# EAGLE schematic PulseRain_M10 (EAGLE 7.7.0)

## Sheet 1 of 14
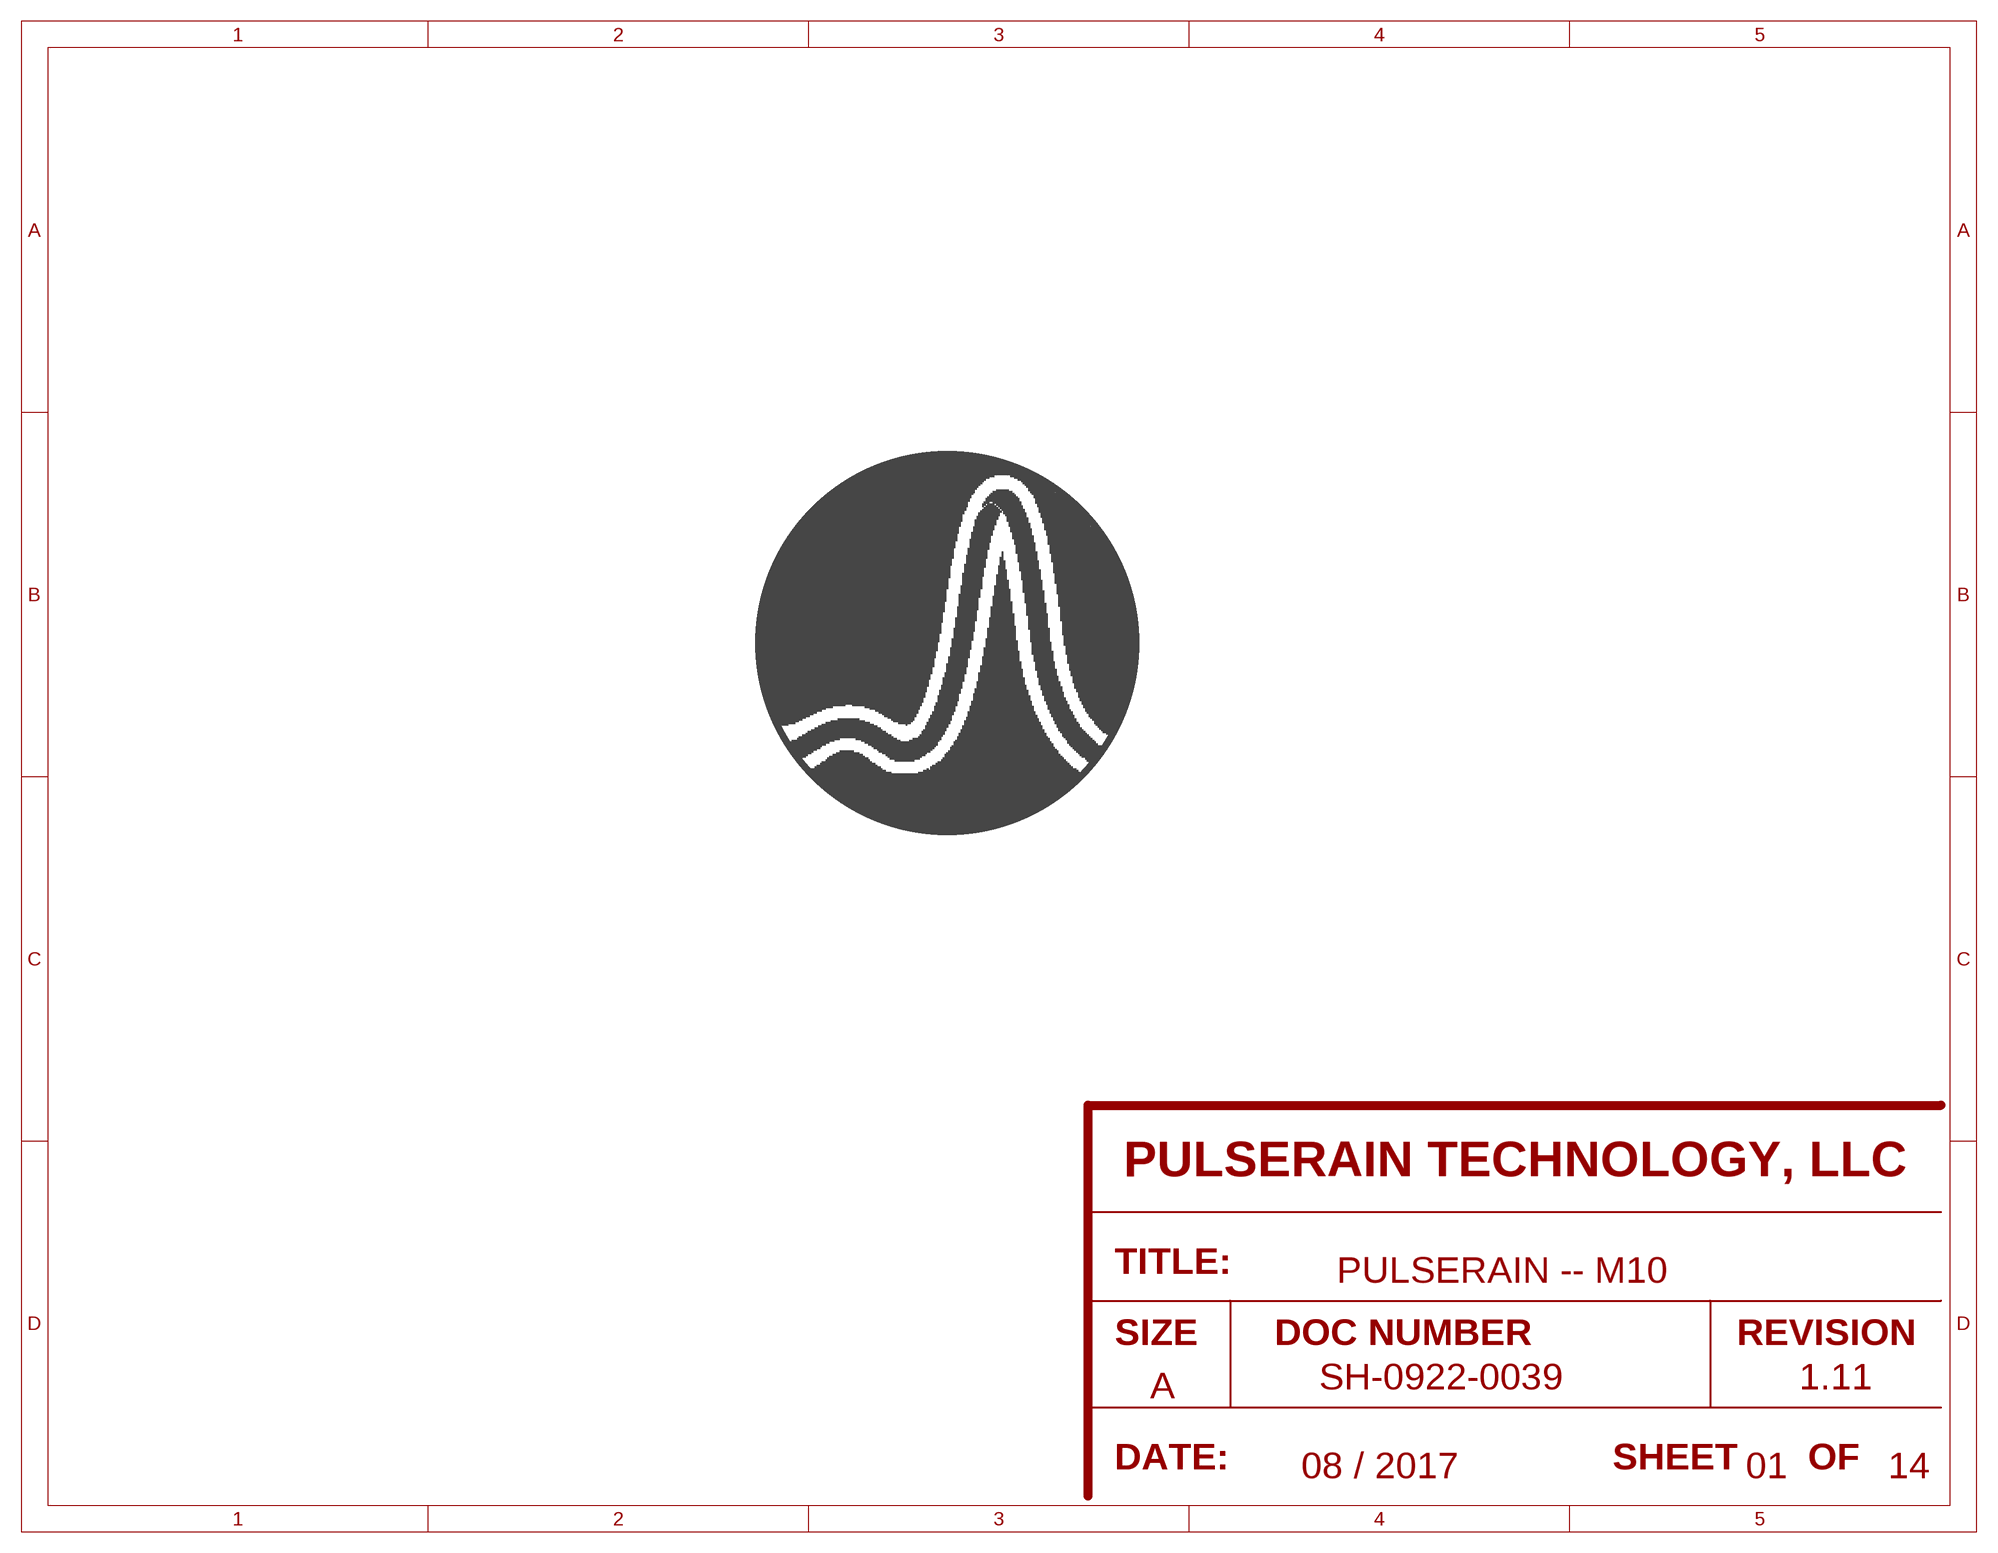
[diagram p0: schematic, sheet 1]

### Parts
GND  PULSERAIN_LOGO_BIGGER  [PULSERAIN_LOGO_BIGGER]

### Notes on the sheet
- PULSERAIN -- M10
- SH-0922-0039 | 1.11
- 08 / 2017 | 01 | 14

## Sheet 2 of 14
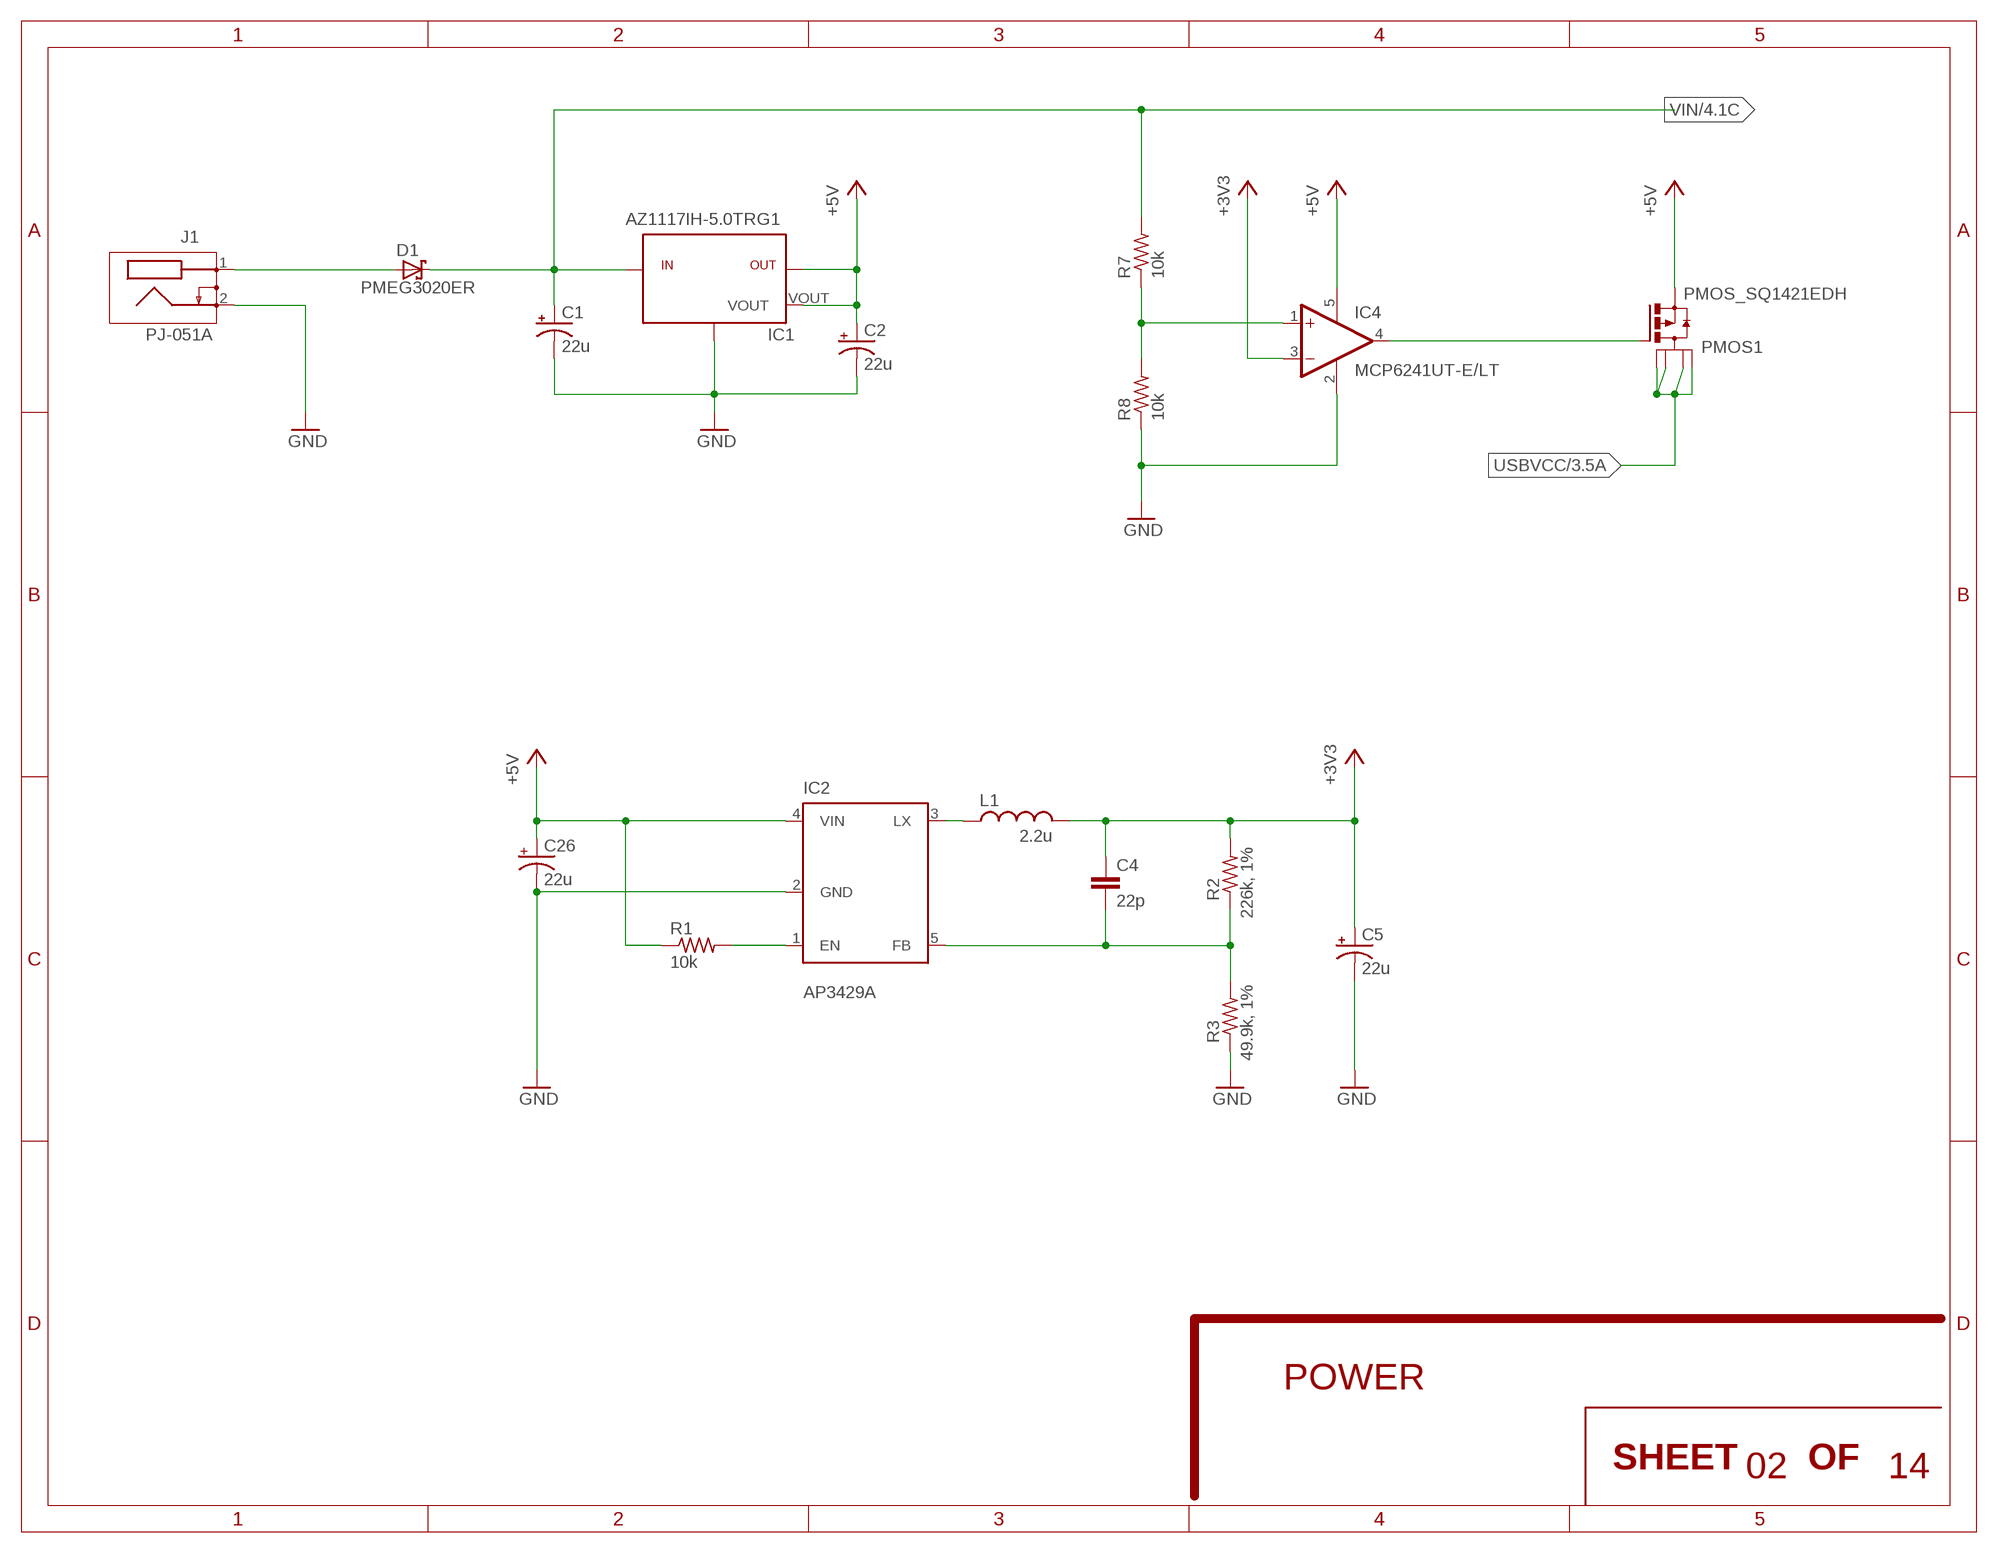
[diagram p1: schematic, sheet 2]

### Parts
C1  22u  CPOL_USB22U  [PANASONIC_B]
C2  22u  CPOL_USB22U  [PANASONIC_B]
C4  22p  C-US_22P  [0603-CAP]
C5  22u  CPOL_USB22U  [PANASONIC_B]
C26  22u  CPOL_USB22U  [PANASONIC_B]
D1  PMEG3020ER  [SOD123W]
IC1  AZ1117IH-5.0TRG1  [SOT223]
IC2  AP3429A  [TSOT25]
IC4  MCP6241UT-E/LT  [SC-70-5]
J1  PJ-051A  [PJ-051A]
L1  2.2u  L-US_2.2U  [DFE252012C]
PMOS1  PMOS_SQ1421EDH  [SC70-6L]
R1  10k  R-US_10K_YAGEO  [VISHAY-R-0603]
R2  226k, 1%  R-US_226K  [VISHAY-R-0603]
R3  49.9k, 1%  R-US_49K9  [VISHAY-R-0603]
R7  10k  R-US_10K_YAGEO  [VISHAY-R-0603]
R8  10k  R-US_10K_YAGEO  [VISHAY-R-0603]

### Nets
+3V3 [supply]: C4.1 C5.+ IC4.3(-IN) L1.2 R2.P$2 ; also sheet 3,4,6,7,8,9,10,11,12,13,14
+5V [supply]: C2.+ C26.+ IC1.2 IC1.VOUT IC2.4(VIN) IC4.5(V+) PMOS1.4(S) R1.P$1 ; also sheet 4,5
GND [supply]: C1.- C2.- C5.- C26.- IC1.1 IC2.2(GND) IC4.2(V-) J1.2 R3.P$1 R8.P$1 ; also sheet 3,4,7,8,10,11,12,13,14
N$1 [supply]: D1.2 J1.1
N$3: IC4.1(+IN) R7.P$1 R8.P$2
N$4 [supply]: IC2.3(LX) L1.1
N$5: IC2.1(EN) R1.P$2
N$6: C4.2 IC2.5(FB) R2.P$1 R3.P$2
N$12: IC4.4(OUT) PMOS1.3(G)
USBVCC [supply]: PMOS1.1(D1) PMOS1.2(D2) PMOS1.5(D3) PMOS1.6(D4) ; also sheet 3
VIN [supply]: C1.+ D1.1 IC1.3 R7.P$2 ; also sheet 4

### Notes on the sheet
- POWER
- 02 | 14

## Sheet 3 of 14
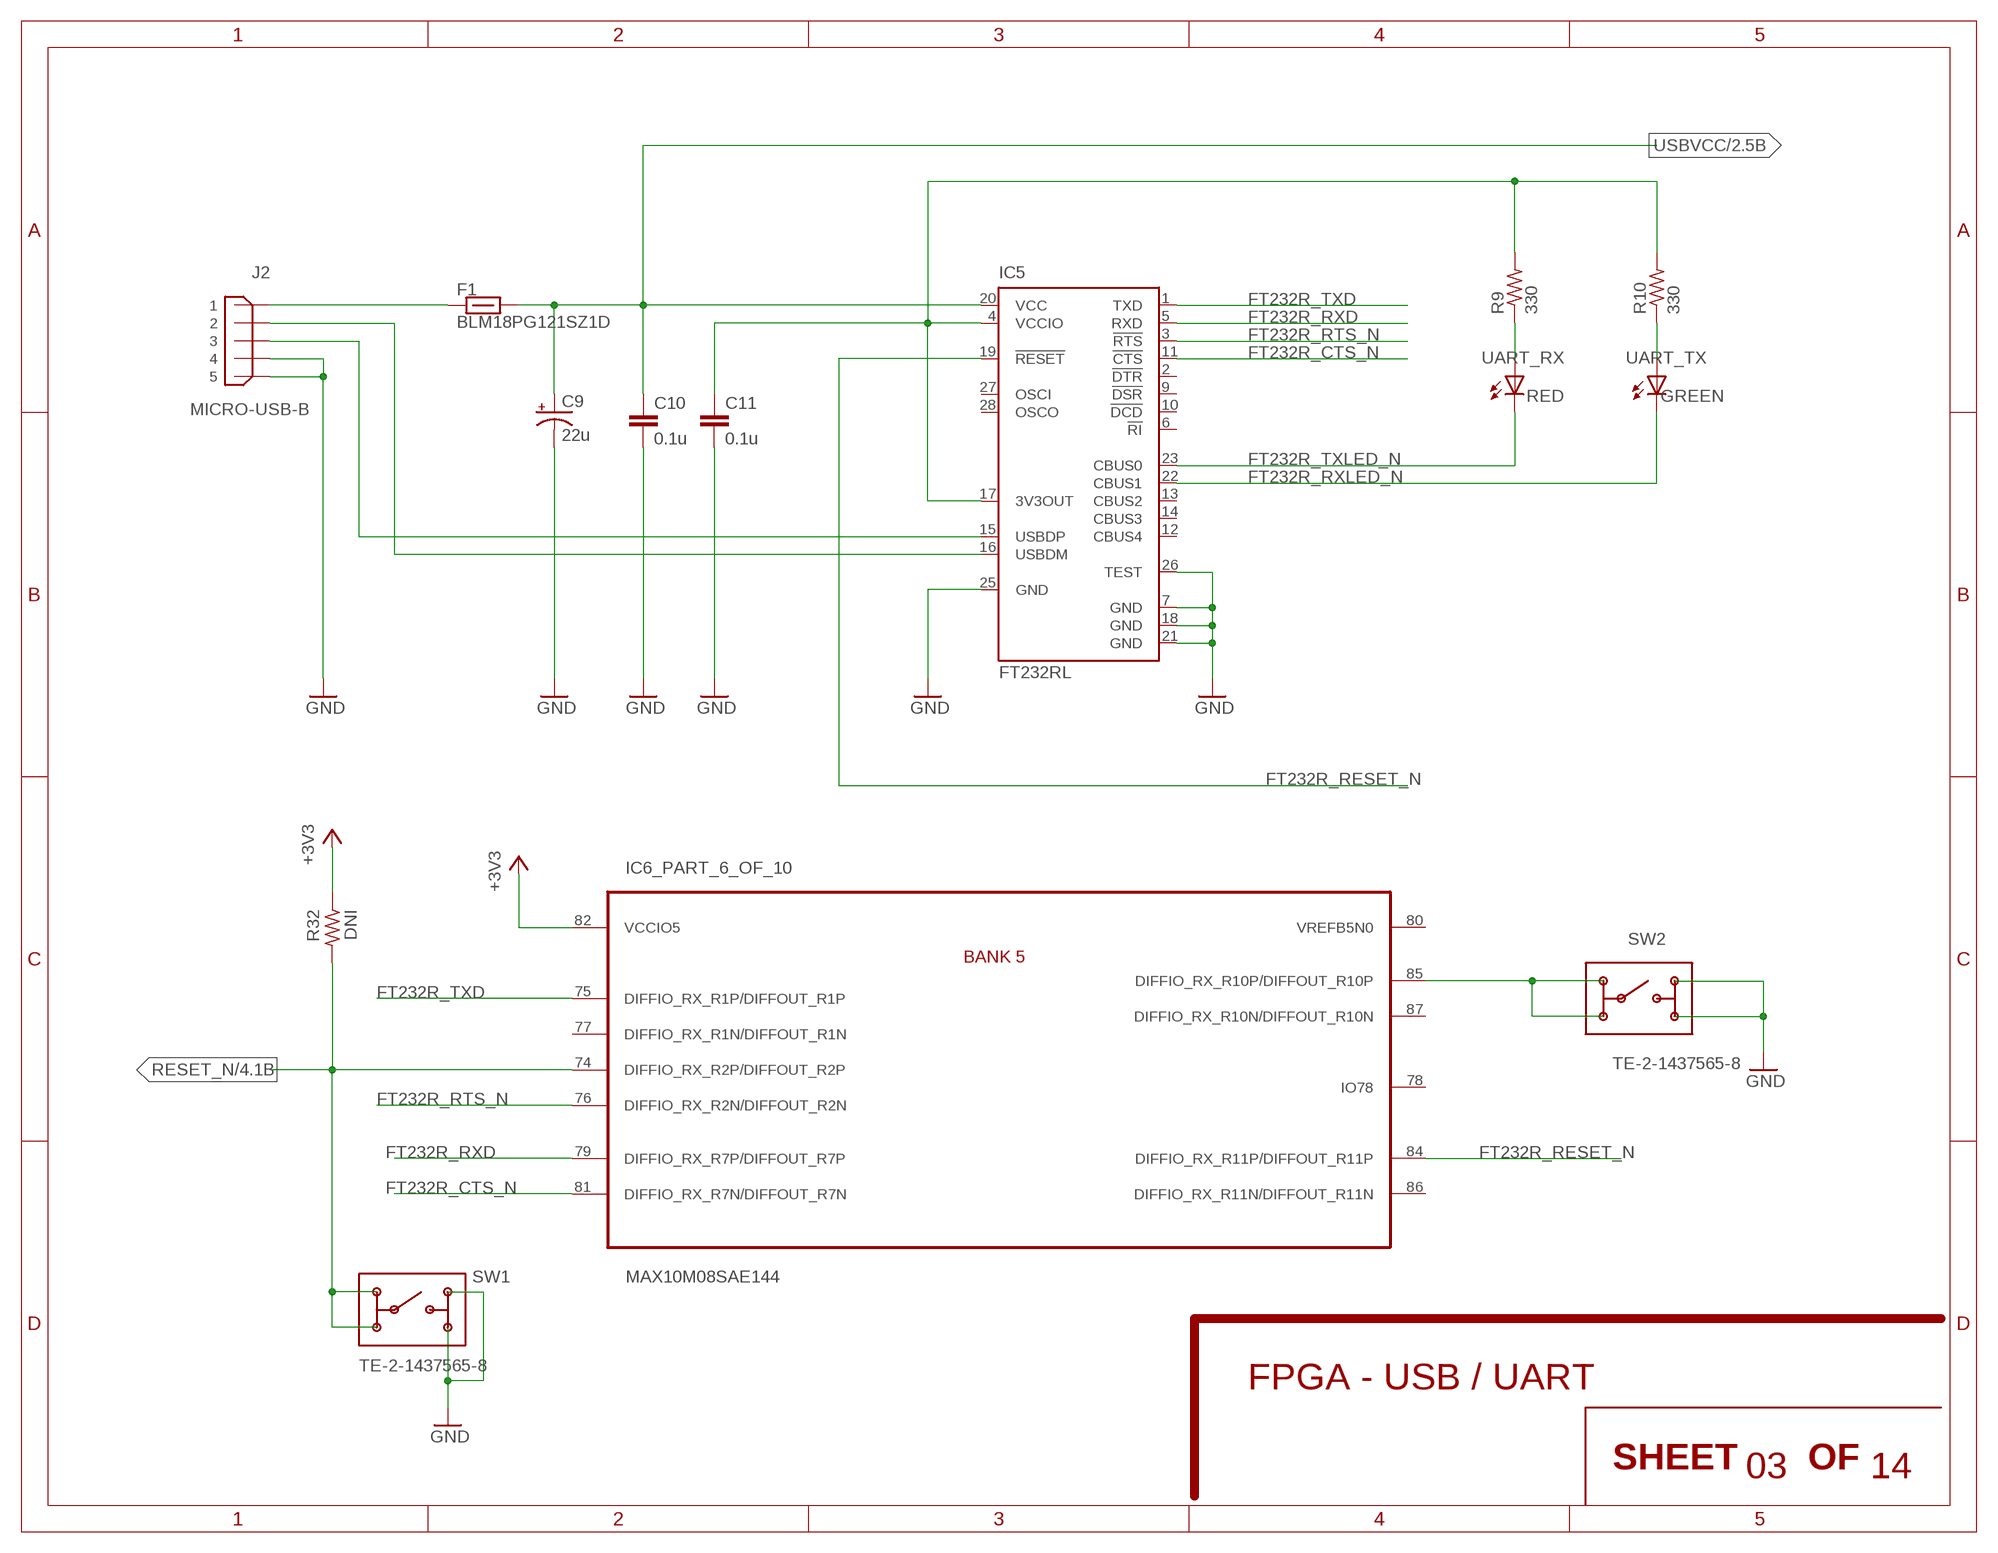
[diagram p2: schematic, sheet 3]

### Parts
C9  22u  CPOL_USB22U  [PANASONIC_B]
C10  0.1u  C-US_0.1U  [0603-CAP]
C11  0.1u  C-US_0.1U  [0603-CAP]
F1  BLM18PG121SZ1D  BLM18PG  [0603-BEAD]
IC5  FT232RL  [SSOP28]
IC6  MAX10M08SAE144  MAX10M08SAE144  [EQFP144]
J2  MICRO-USB-B  MICRO-USB-B-REC-47346-001  [SD-47346-001]
R9  330  R-US_330_YAGEO  [VISHAY-R-0603]
R10  330  R-US_330_YAGEO  [VISHAY-R-0603]
R32  DNI  R-US_10K  [VISHAY-R-0603]
SW1  TE-2-1437565-8  PUSH_BUTTON  [TE-2-1437565-8]
SW2  TE-2-1437565-8  PUSH_BUTTON  [TE-2-1437565-8]
UART_RX  RED  HT--191URO-5502-RED  [HARVATEK_0603]
UART_TX  GREEN  HT--193UYG-5592-GREEN  [HARVATEK_0603]

### Nets
+3V3 [supply]: IC6.82(_PART_6_OF_10:VCCIO5) R32.P$1 ; also sheet 2,4,6,7,8,9,10,11,12,13,14
FT232R_CTS_N: IC5.11(!CTS) IC6.81(_PART_6_OF_10:DIFFIO_RX_R7N/DIFFOUT_R7N)
FT232R_RESET_N: IC5.19(!RESET) IC6.84(_PART_6_OF_10:DIFFIO_RX_R11P/DIFFOUT_R11P)
FT232R_RTS_N: IC5.3(!RTS) IC6.76(_PART_6_OF_10:DIFFIO_RX_R2N/DIFFOUT_R2N)
FT232R_RXD: IC5.5(RXD) IC6.79(_PART_6_OF_10:DIFFIO_RX_R7P/DIFFOUT_R7P)
FT232R_RXLED_N: IC5.22(CBUS1) UART_TX.C
FT232R_TXD: IC5.1(TXD) IC6.75(_PART_6_OF_10:DIFFIO_RX_R1P/DIFFOUT_R1P)
FT232R_TXLED_N: IC5.23(CBUS0) UART_RX.C
GND [supply]: C9.- C10.2 C11.2 IC5.7(GND) IC5.18(GND) IC5.21(GND) IC5.25(GND) IC5.26(TEST) J2.4 J2.5 SW1.3 SW1.4 SW2.3 SW2.4 ; also sheet 2,4,7,8,10,11,12,13,14
N$7 [supply]: F1.1 J2.1
N$13: IC6.85(_PART_6_OF_10:DIFFIO_RX_R10P/DIFFOUT_R10P) SW2.1 SW2.2
N$15 [supply]: C11.1 IC5.4(VCCIO) IC5.17(3V3OUT) R9.P$2 R10.P$2
N$16: R9.P$1 UART_RX.A
N$17: R10.P$1 UART_TX.A
RESET_N: IC6.74(_PART_6_OF_10:DIFFIO_RX_R2P/DIFFOUT_R2P) R32.P$2 SW1.1 SW1.2 ; also sheet 4
USB_DATA_N [diff]: IC5.16(USBDM) J2.2
USB_DATA_P [diff]: IC5.15(USBDP) J2.3
USBVCC [supply]: C9.+ C10.1 F1.2 IC5.20(VCC) ; also sheet 2
Unconnected: IC5.2(!DTR) IC5.6(!RI) IC5.9(!DSR) IC5.10(!DCD) IC5.12(CBUS4) IC5.13(CBUS2) IC5.14(CBUS3) IC5.27(OSCI) IC5.28(OSCO) IC6.77(_PART_6_OF_10:DIFFIO_RX_R1N/DIFFOUT_R1N) IC6.78(_PART_6_OF_10:IO78) IC6.80(_PART_6_OF_10:VREFB5N0) IC6.86(_PART_6_OF_10:DIFFIO_RX_R11N/DIFFOUT_R11N) IC6.87(_PART_6_OF_10:DIFFIO_RX_R10N/DIFFOUT_R10N)

### Notes on the sheet
- FPGA - USB / UART
- 03 | 14

## Sheet 4 of 14
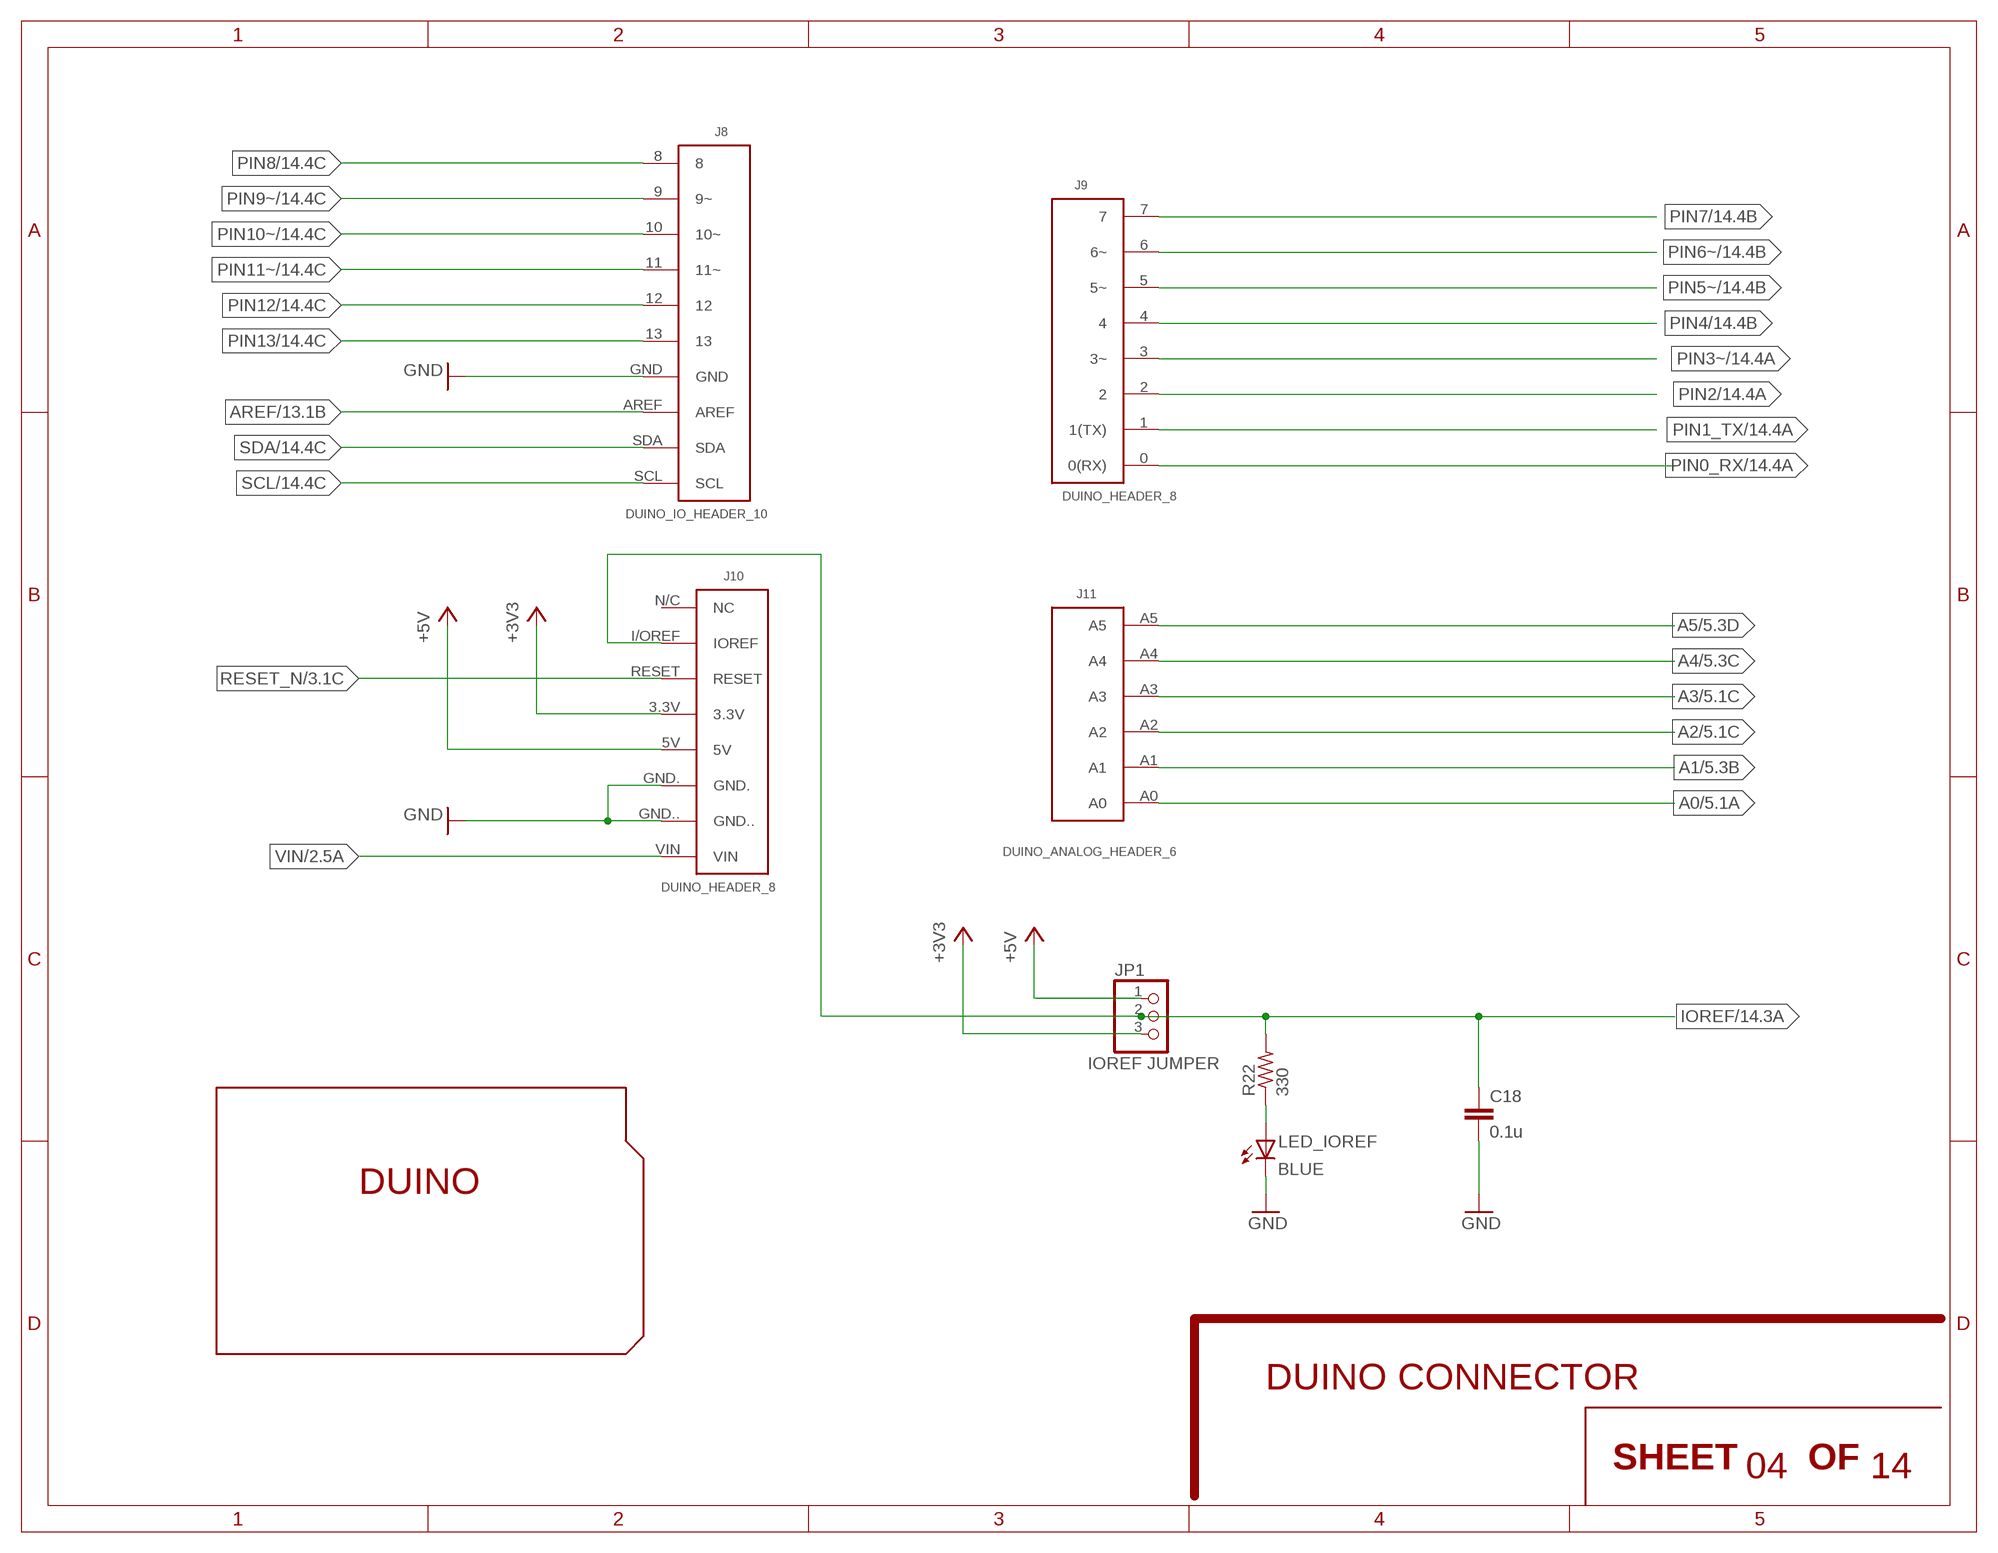
[diagram p3: schematic, sheet 4]

### Parts
C18  0.1u  C-US_0.1U  [0603-CAP]
J8  DUINO_IO_HEADER_10  [DUINO_IO_HEADER_10]
J9  DUINO_HEADER_8  DUINO_IO_HEADER_8  [DUINO_IO_HEADER_8]
J10  DUINO_HEADER_8  DUINO_PWR_HEADER_8  [DUINO_PWR_HEADER_8]
J11  DUINO_ANALOG_HEADER_6  [DUINO_ANALOG_HEADER_6]
JP1  IOREF JUMPER  PINHD-1X3  [1X03]
LED_IOREF  BLUE  HT--193NB-5589-BLUE  [HARVATEK_0603]
R22  330  R-US_330_YAGEO  [VISHAY-R-0603]
U$8  DUINO  [DUINO]

### Nets
+3V3 [supply]: J10.3.3V JP1.3 ; also sheet 2,3,6,7,8,9,10,11,12,13,14
+5V [supply]: J10.5V JP1.1 ; also sheet 2,5
A0: J11.A0 ; also sheet 5
A1: J11.A1 ; also sheet 5
A2: J11.A2 ; also sheet 5
A3: J11.A3 ; also sheet 5
A4: J11.A4 ; also sheet 5
A5: J11.A5 ; also sheet 5
AREF: J8.AREF ; also sheet 13
GND [supply]: C18.2 J8.GND J10.GND. J10.GND.. LED_IOREF.C ; also sheet 2,3,7,8,10,11,12,13,14
IOREF: C18.1 J10.I/OREF(IOREF) JP1.2 R22.P$2 ; also sheet 14
N$18: LED_IOREF.A R22.P$1
PIN0_RX: J9.0(0(RX)) ; also sheet 14
PIN1_TX: J9.1(1(TX)) ; also sheet 14
PIN2: J9.2 ; also sheet 14
PIN3~: J9.3(3~) ; also sheet 14
PIN4: J9.4 ; also sheet 14
PIN5~: J9.5(5~) ; also sheet 14
PIN6~: J9.6(6~) ; also sheet 14
PIN7: J9.7 ; also sheet 14
PIN8: J8.8 ; also sheet 14
PIN9~: J8.9(9~) ; also sheet 14
PIN10~: J8.10(10~) ; also sheet 14
PIN11~: J8.11(11~) ; also sheet 14
PIN12: J8.12 ; also sheet 14
PIN13: J8.13 ; also sheet 14
RESET_N: J10.RESET ; also sheet 3
SCL: J8.SCL ; also sheet 14
SDA: J8.SDA ; also sheet 14
VIN [supply]: J10.VIN ; also sheet 2
Unconnected: J10.N/C(NC)

### Notes on the sheet
- DUINO CONNECTOR
- 04 | 14

## Sheet 5 of 14
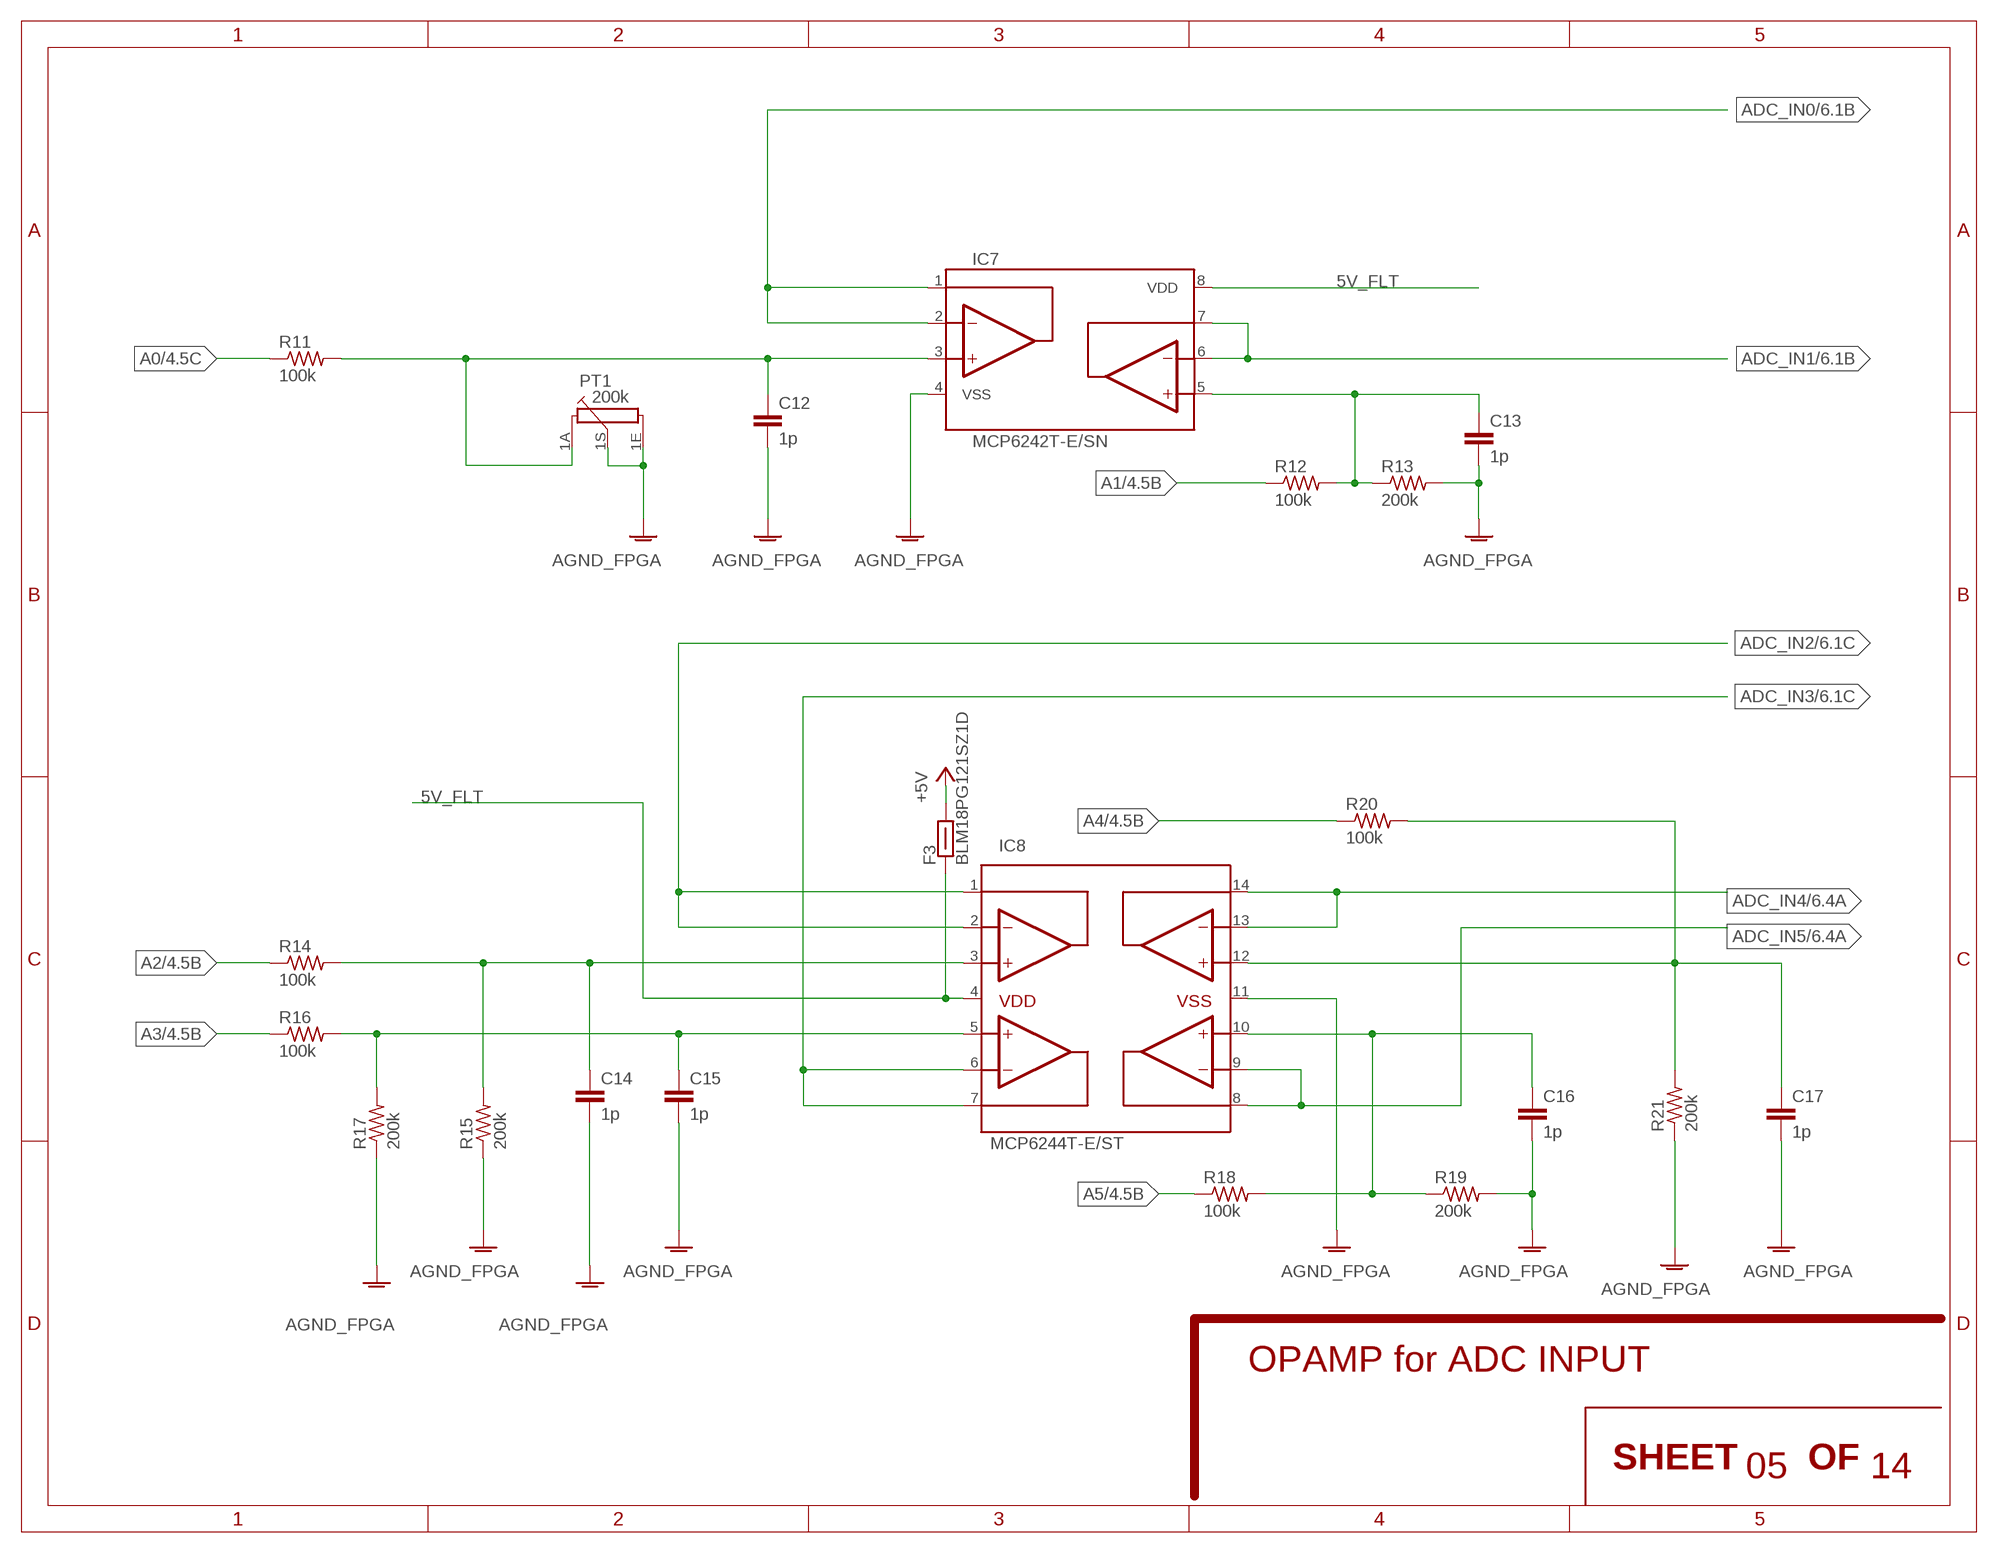
[diagram p4: schematic, sheet 5]

### Parts
C12  1p  C-US_1P  [0603-CAP]
C13  1p  C-US_1P  [0603-CAP]
C14  1p  C-US_1P  [0603-CAP]
C15  1p  C-US_1P  [0603-CAP]
C16  1p  C-US_1P  [0603-CAP]
C17  1p  C-US_1P  [0603-CAP]
F3  BLM18PG121SZ1D  BLM18PG  [0603-BEAD]
IC7  MCP6242T-E/SN  [SOIC-SN-8]
IC8  MCP6244T-E/ST  [TSSOP-ST-14]
PT1  200k  PT10LV10  [PT10LV10]
R11  100k  R-US_100K_YAGEO  [VISHAY-R-0603]
R12  100k  R-US_100K_YAGEO  [VISHAY-R-0603]
R13  200k  R-US_200K  [VISHAY-R-0603]
R14  100k  R-US_100K_YAGEO  [VISHAY-R-0603]
R15  200k  R-US_200K  [VISHAY-R-0603]
R16  100k  R-US_100K_YAGEO  [VISHAY-R-0603]
R17  200k  R-US_200K  [VISHAY-R-0603]
R18  100k  R-US_100K_YAGEO  [VISHAY-R-0603]
R19  200k  R-US_200K  [VISHAY-R-0603]
R20  100k  R-US_100K_YAGEO  [VISHAY-R-0603]
R21  200k  R-US_200K  [VISHAY-R-0603]

### Nets
5V_FLT: F3.1 IC7.8(VDD) IC8.4
+5V [supply]: F3.2 ; also sheet 2,4
A0: R11.P$1 ; also sheet 4
A1: R12.P$1 ; also sheet 4
A2: R14.P$1 ; also sheet 4
A3: R16.P$1 ; also sheet 4
A4: R20.P$1 ; also sheet 4
A5: R18.P$1 ; also sheet 4
ADC_IN0: IC7.1 IC7.2 ; also sheet 6
ADC_IN1: IC7.6 IC7.7 ; also sheet 6
ADC_IN2: IC8.1 IC8.2 ; also sheet 6
ADC_IN3: IC8.6 IC8.7 ; also sheet 6
ADC_IN4: IC8.13 IC8.14 ; also sheet 6
ADC_IN5: IC8.8 IC8.9 ; also sheet 6
AGND_FPGA [supply]: C12.2 C13.2 C14.2 C15.2 C16.2 C17.2 IC7.4(VSS) IC8.11 PT1.1E PT1.1S R13.P$2 R15.P$1 R17.P$1 R19.P$2 R21.P$1 ; also sheet 6,13
N$19: C13.1 IC7.5 R12.P$2 R13.P$1
N$20: C16.1 IC8.10 R18.P$2 R19.P$1
N$22: C14.1 IC8.3 R14.P$2 R15.P$2
N$23: C15.1 IC8.5 R16.P$2 R17.P$2
N$27: C12.1 IC7.3 PT1.1A R11.P$2
N$28: C17.1 IC8.12 R20.P$2 R21.P$2

### Notes on the sheet
- OPAMP for ADC INPUT
- 05 | 14

## Sheet 6 of 14
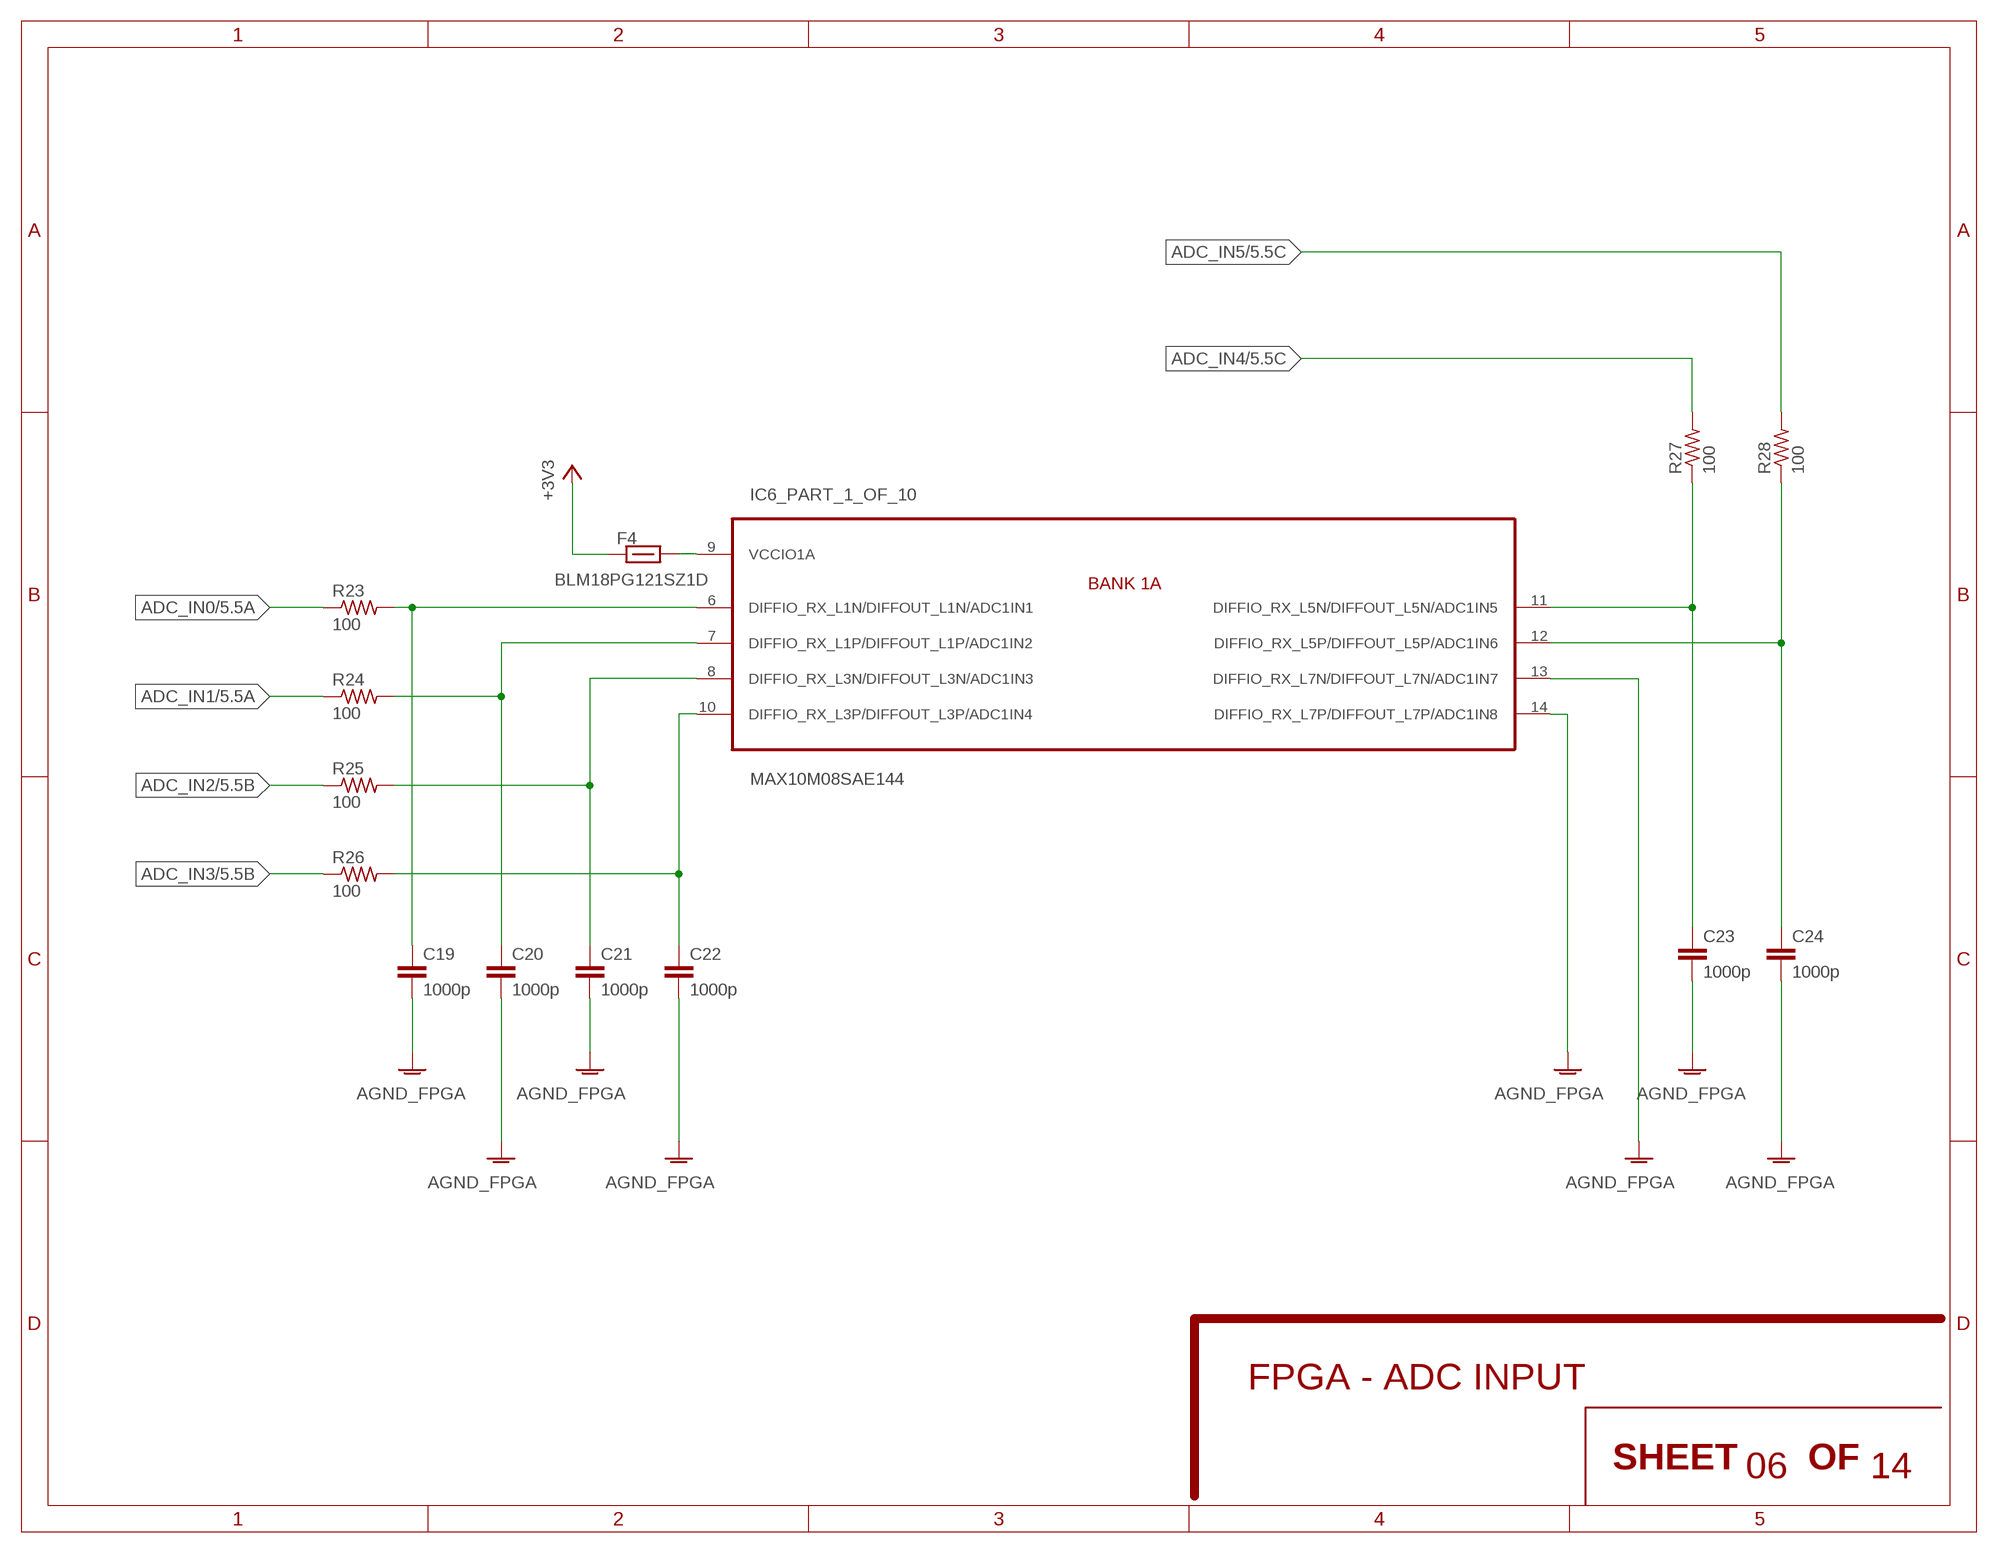
[diagram p5: schematic, sheet 6]

### Parts
C19  1000p  C-US_1000P  [VISHAY-R-0603]
C20  1000p  C-US_1000P  [VISHAY-R-0603]
C21  1000p  C-US_1000P  [VISHAY-R-0603]
C22  1000p  C-US_1000P  [VISHAY-R-0603]
C23  1000p  C-US_1000P  [VISHAY-R-0603]
C24  1000p  C-US_1000P  [VISHAY-R-0603]
F4  BLM18PG121SZ1D  BLM18PG  [0603-BEAD]
R23  100  R-US_100  [VISHAY-R-0603]
R24  100  R-US_100  [VISHAY-R-0603]
R25  100  R-US_100  [VISHAY-R-0603]
R26  100  R-US_100  [VISHAY-R-0603]
R27  100  R-US_100  [VISHAY-R-0603]
R28  100  R-US_100  [VISHAY-R-0603]

### Nets
+3V3 [supply]: F4.1 ; also sheet 2,3,4,7,8,9,10,11,12,13,14
ADC_IN0: R23.P$1 ; also sheet 5
ADC_IN1: R24.P$1 ; also sheet 5
ADC_IN2: R25.P$1 ; also sheet 5
ADC_IN3: R26.P$1 ; also sheet 5
ADC_IN4: R27.P$2 ; also sheet 5
ADC_IN5: R28.P$2 ; also sheet 5
AGND_FPGA [supply]: C19.P$2 C20.P$2 C21.P$2 C22.P$2 C23.P$2 C24.P$2 IC6.13(_PART_1_OF_10:DIFFIO_RX_L7N/DIFFOUT_L7N/ADC1IN7) IC6.14(_PART_1_OF_10:DIFFIO_RX_L7P/DIFFOUT_L7P/ADC1IN8) ; also sheet 5,13
N$14: C23.P$1 IC6.11(_PART_1_OF_10:DIFFIO_RX_L5N/DIFFOUT_L5N/ADC1IN5) R27.P$1
N$24: C19.P$1 IC6.6(_PART_1_OF_10:DIFFIO_RX_L1N/DIFFOUT_L1N/ADC1IN1) R23.P$2
N$25: C20.P$1 IC6.7(_PART_1_OF_10:DIFFIO_RX_L1P/DIFFOUT_L1P/ADC1IN2) R24.P$2
N$26: C21.P$1 IC6.8(_PART_1_OF_10:DIFFIO_RX_L3N/DIFFOUT_L3N/ADC1IN3) R25.P$2
N$29: C22.P$1 IC6.10(_PART_1_OF_10:DIFFIO_RX_L3P/DIFFOUT_L3P/ADC1IN4) R26.P$2
N$30: C24.P$1 IC6.12(_PART_1_OF_10:DIFFIO_RX_L5P/DIFFOUT_L5P/ADC1IN6) R28.P$1
N$34: F4.2 IC6.9(_PART_1_OF_10:VCCIO1A)

### Notes on the sheet
- FPGA - ADC INPUT
- 06 | 14

## Sheet 7 of 14
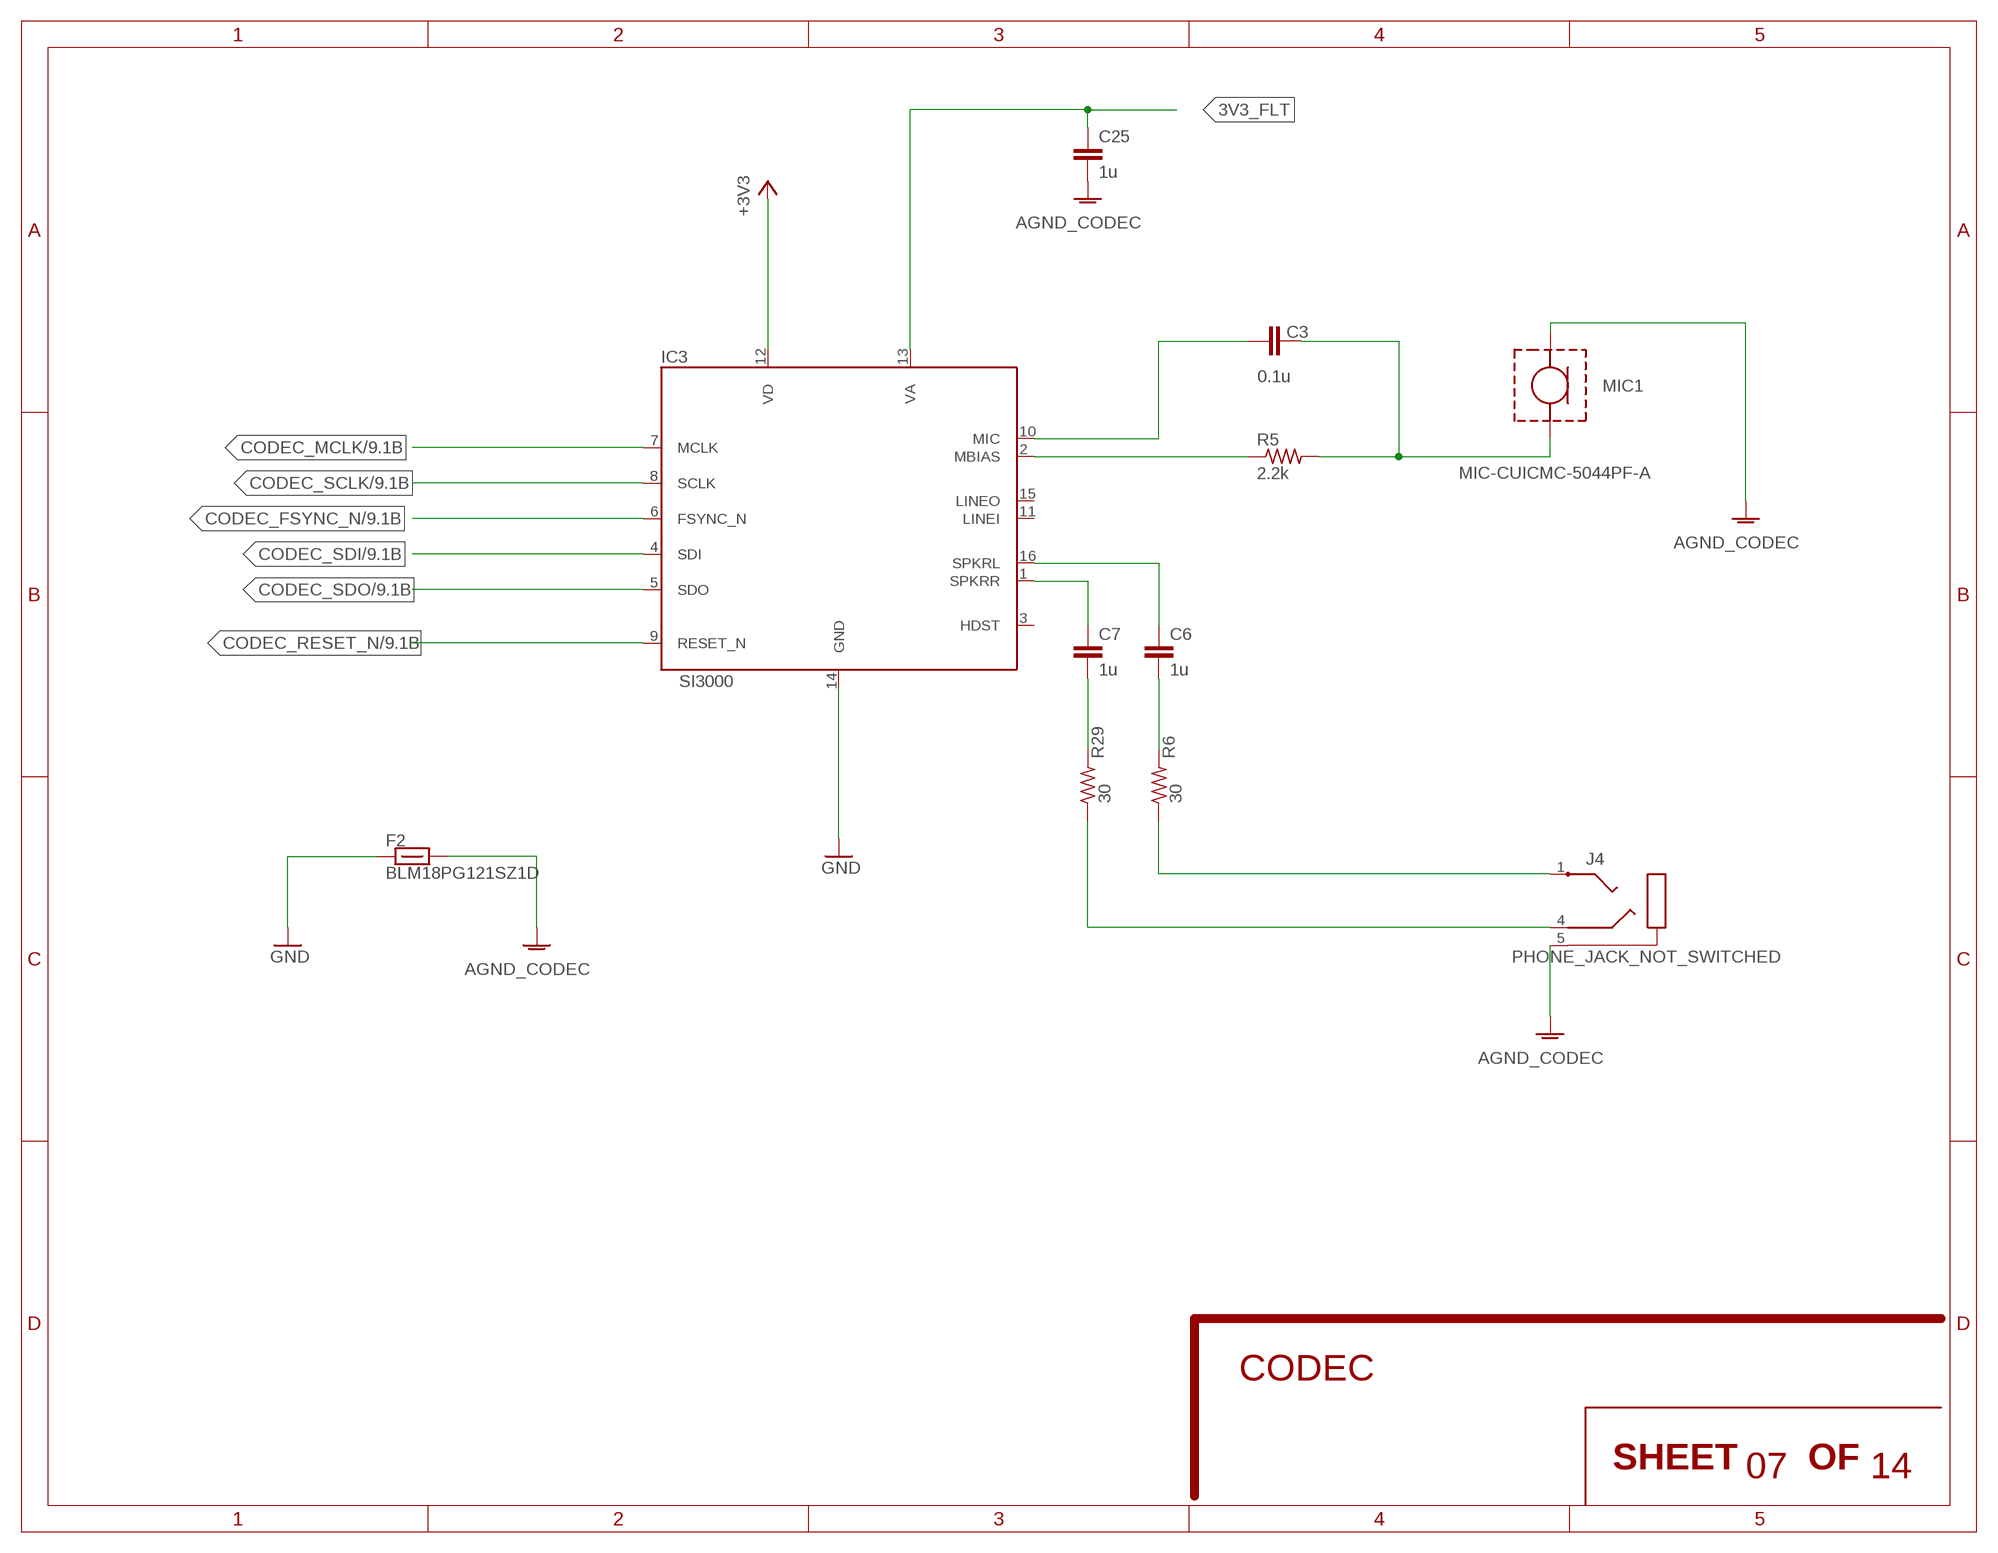
[diagram p6: schematic, sheet 7]

### Parts
C3  0.1u  C-US_0.1U  [0603-CAP]
C6  1u  C-US_1U  [VISHAY-R-0603]
C7  1u  C-US_1U  [VISHAY-R-0603]
C25  1u  C-US_1U  [VISHAY-R-0603]
F2  BLM18PG121SZ1D  BLM18PG  [0603-BEAD]
IC3  SI3000  SI3000-C-FS  [SOIC-16]
J4  PHONE_JACK_NOT_SWITCHED  [PHONE_JACK_NOT_SWITCHED]
MIC1  MIC-CUICMC-5044PF-A  [CMC-5044PF-A]
R5  2.2k  R-US_2.2K  [VISHAY-R-0603]
R6  30  R-US_30  [VISHAY-R-0603]
R29  30  R-US_30  [VISHAY-R-0603]

### Nets
3V3_FLT: C25.P$1 IC3.13(VA) ; also sheet 13
+3V3 [supply]: IC3.12(VD) ; also sheet 2,3,4,6,8,9,10,11,12,13,14
AGND_CODEC [supply]: C25.P$2 F2.2 J4.5 MIC1.1
CODEC_FSYNC_N: IC3.6(FSYNC_N) ; also sheet 9
CODEC_MCLK: IC3.7(MCLK) ; also sheet 9
CODEC_RESET_N: IC3.9(RESET_N) ; also sheet 9
CODEC_SCLK: IC3.8(SCLK) ; also sheet 9
CODEC_SDI: IC3.4(SDI) ; also sheet 9
CODEC_SDO: IC3.5(SDO) ; also sheet 9
GND [supply]: F2.1 IC3.14(GND) ; also sheet 2,3,4,8,10,11,12,13,14
N$8: C3.1 IC3.10(MIC)
N$9: C6.P$1 IC3.16(SPKRL)
N$10: C3.2 MIC1.2 R5.P$2
N$36: IC3.2(MBIAS) R5.P$1
N$37: C7.P$1 IC3.1(SPKRR)
N$39: C7.P$2 R29.P$2
N$41: C6.P$2 R6.P$2
N$42: J4.1 R6.P$1
N$43: J4.4 R29.P$1
Unconnected: IC3.3(HDST) IC3.11(LINEI) IC3.15(LINEO)

### Notes on the sheet
- CODEC
- 07 | 14

## Sheet 8 of 14
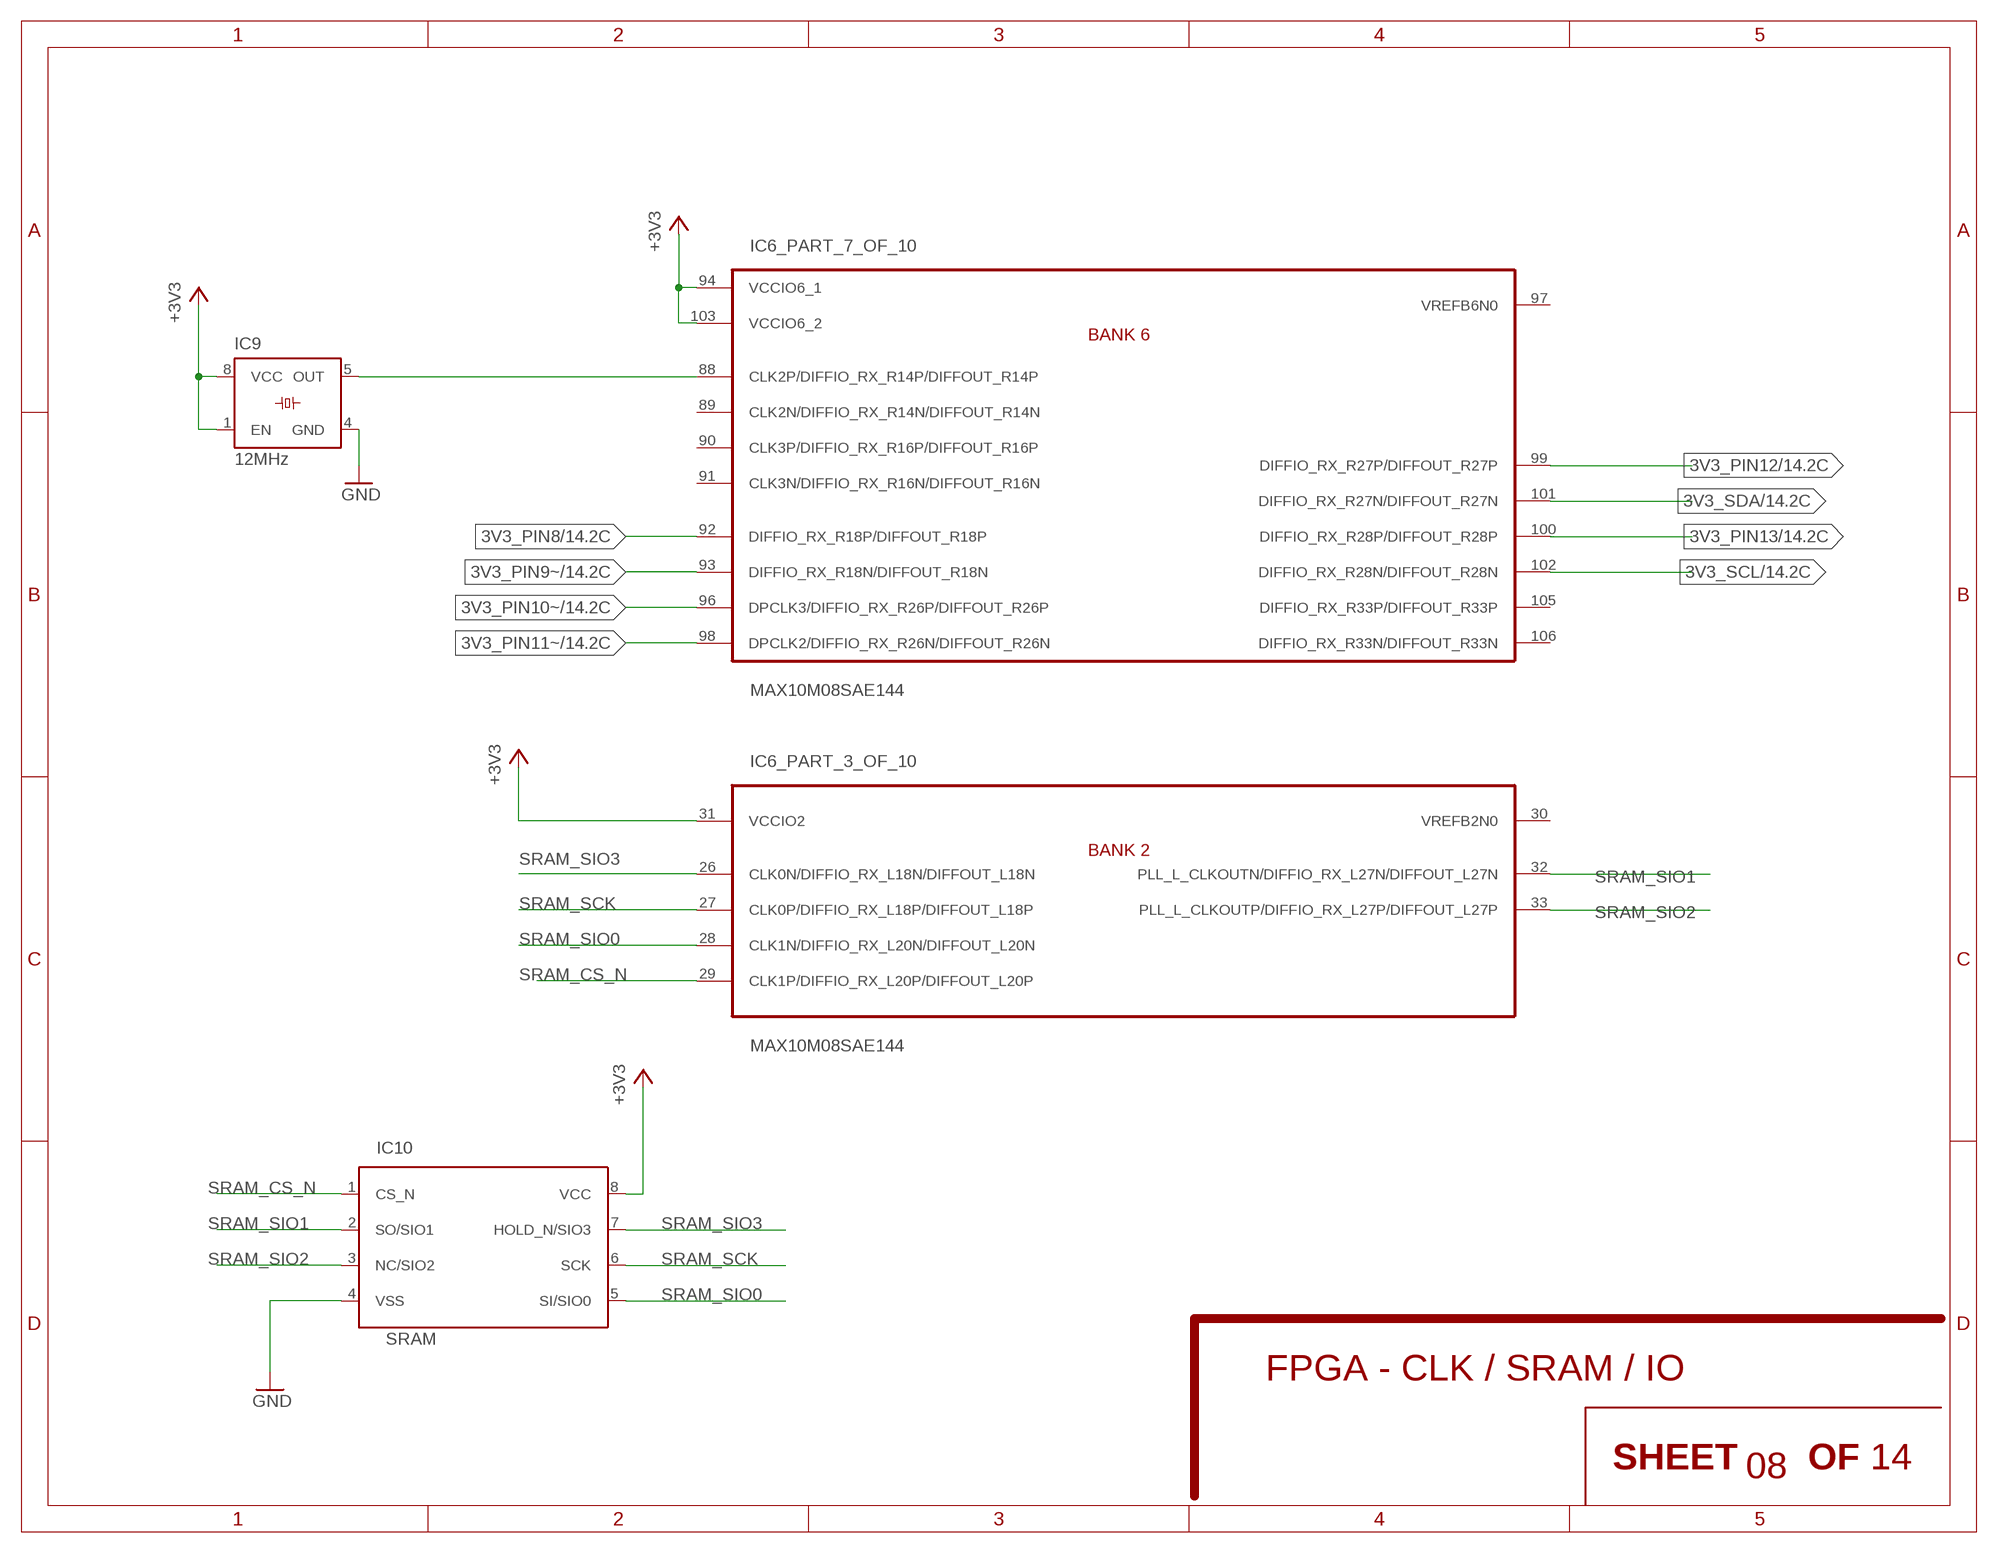
[diagram p7: schematic, sheet 8]

### Parts
IC9  12MHz  ACHL-DIPACHL-12.000MHZ-EK  [ACHL-DIP]
IC10  SRAM  23LC1024  [TSSOP-ST-8]

### Nets
3V3_PIN8: IC6.92(_PART_7_OF_10:DIFFIO_RX_R18P/DIFFOUT_R18P) ; also sheet 14
3V3_PIN9~: IC6.93(_PART_7_OF_10:DIFFIO_RX_R18N/DIFFOUT_R18N) ; also sheet 14
3V3_PIN10~: IC6.96(_PART_7_OF_10:DPCLK3/DIFFIO_RX_R26P/DIFFOUT_R26P) ; also sheet 14
3V3_PIN11~: IC6.98(_PART_7_OF_10:DPCLK2/DIFFIO_RX_R26N/DIFFOUT_R26N) ; also sheet 14
3V3_PIN12: IC6.99(_PART_7_OF_10:DIFFIO_RX_R27P/DIFFOUT_R27P) ; also sheet 14
3V3_PIN13: IC6.100(_PART_7_OF_10:DIFFIO_RX_R28P/DIFFOUT_R28P) ; also sheet 14
3V3_SCL: IC6.102(_PART_7_OF_10:DIFFIO_RX_R28N/DIFFOUT_R28N) ; also sheet 14
3V3_SDA: IC6.101(_PART_7_OF_10:DIFFIO_RX_R27N/DIFFOUT_R27N) ; also sheet 14
+3V3 [supply]: IC6.31(_PART_3_OF_10:VCCIO2) IC6.94(_PART_7_OF_10:VCCIO6_1) IC6.103(_PART_7_OF_10:VCCIO6_2) IC9.1(EN) IC9.8(VCC) IC10.8(VCC) ; also sheet 2,3,4,6,7,9,10,11,12,13,14
GND [supply]: IC9.4(GND) IC10.4(VSS) ; also sheet 2,3,4,7,10,11,12,13,14
N$2: IC6.88(_PART_7_OF_10:CLK2P/DIFFIO_RX_R14P/DIFFOUT_R14P) IC9.5(OUT)
SRAM_CS_N: IC6.29(_PART_3_OF_10:CLK1P/DIFFIO_RX_L20P/DIFFOUT_L20P) IC10.1(CS_N)
SRAM_SCK: IC6.27(_PART_3_OF_10:CLK0P/DIFFIO_RX_L18P/DIFFOUT_L18P) IC10.6(SCK)
SRAM_SIO0: IC6.28(_PART_3_OF_10:CLK1N/DIFFIO_RX_L20N/DIFFOUT_L20N) IC10.5(SI/SIO0)
SRAM_SIO1: IC6.32(_PART_3_OF_10:PLL_L_CLKOUTN/DIFFIO_RX_L27N/DIFFOUT_L27N) IC10.2(SO/SIO1)
SRAM_SIO2: IC6.33(_PART_3_OF_10:PLL_L_CLKOUTP/DIFFIO_RX_L27P/DIFFOUT_L27P) IC10.3(NC/SIO2)
SRAM_SIO3: IC6.26(_PART_3_OF_10:CLK0N/DIFFIO_RX_L18N/DIFFOUT_L18N) IC10.7(HOLD_N/SIO3)
Unconnected: IC6.30(_PART_3_OF_10:VREFB2N0) IC6.89(_PART_7_OF_10:CLK2N/DIFFIO_RX_R14N/DIFFOUT_R14N) IC6.90(_PART_7_OF_10:CLK3P/DIFFIO_RX_R16P/DIFFOUT_R16P) IC6.91(_PART_7_OF_10:CLK3N/DIFFIO_RX_R16N/DIFFOUT_R16N) IC6.97(_PART_7_OF_10:VREFB6N0) IC6.105(_PART_7_OF_10:DIFFIO_RX_R33P/DIFFOUT_R33P) IC6.106(_PART_7_OF_10:DIFFIO_RX_R33N/DIFFOUT_R33N)

### Notes on the sheet
- FPGA - CLK / SRAM / IO
- 08 | 14

## Sheet 9 of 14
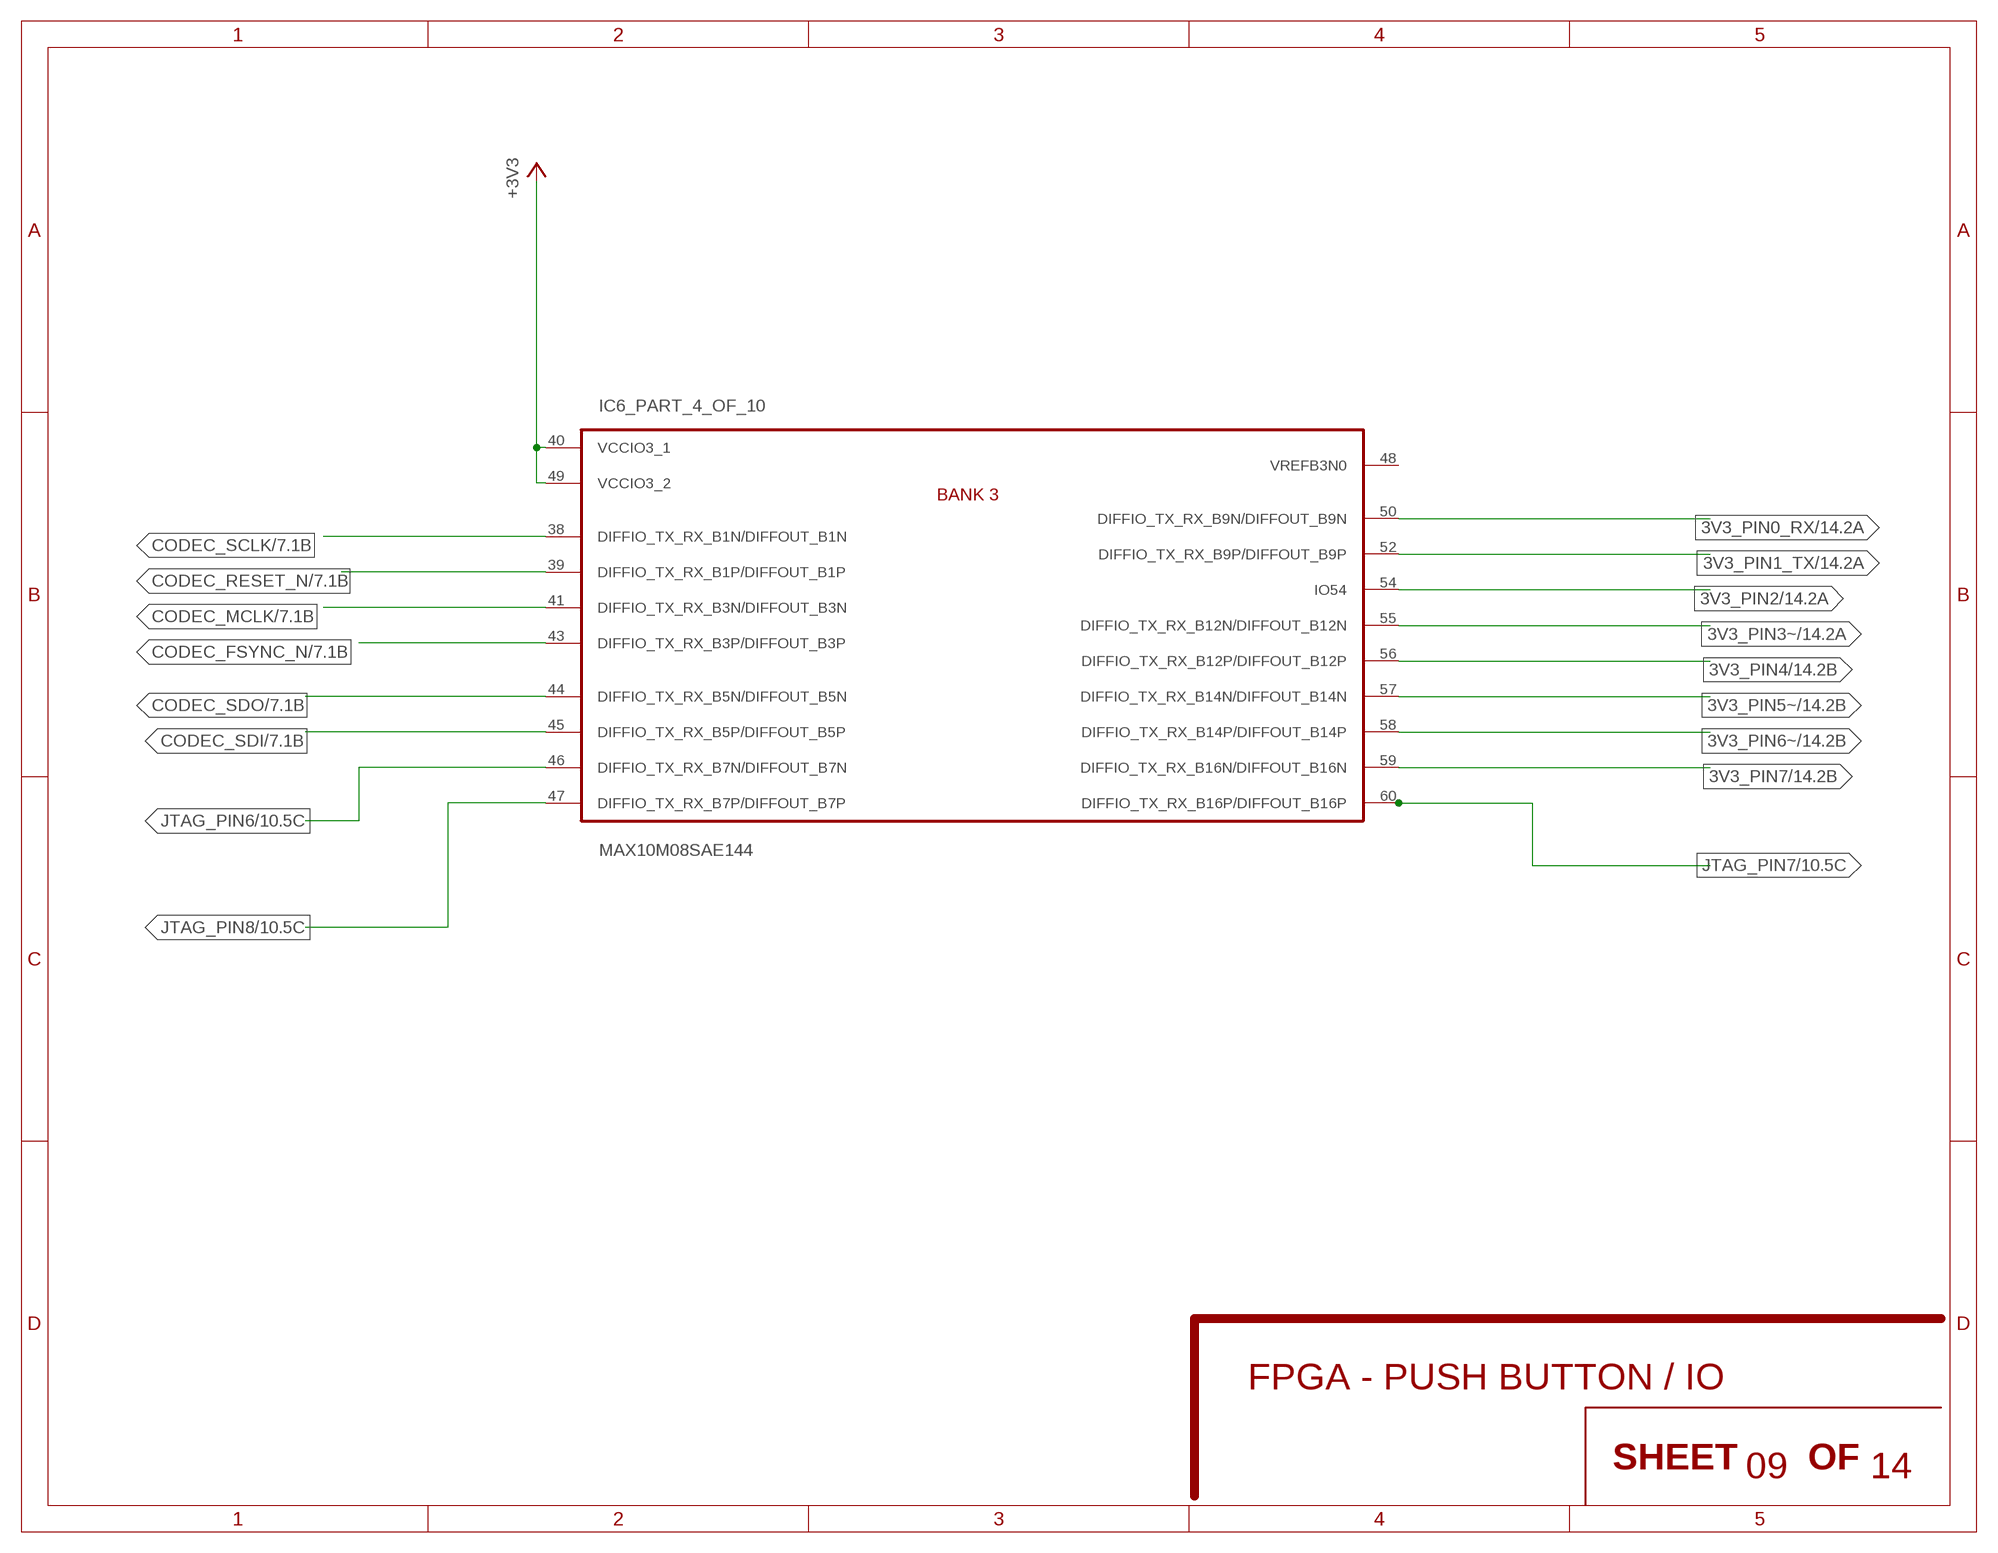
[diagram p8: schematic, sheet 9]

### Nets
3V3_PIN0_RX: IC6.50(_PART_4_OF_10:DIFFIO_TX_RX_B9N/DIFFOUT_B9N) ; also sheet 14
3V3_PIN1_TX: IC6.52(_PART_4_OF_10:DIFFIO_TX_RX_B9P/DIFFOUT_B9P) ; also sheet 14
3V3_PIN2: IC6.54(_PART_4_OF_10:IO54) ; also sheet 14
3V3_PIN3~: IC6.55(_PART_4_OF_10:DIFFIO_TX_RX_B12N/DIFFOUT_B12N) ; also sheet 14
3V3_PIN4: IC6.56(_PART_4_OF_10:DIFFIO_TX_RX_B12P/DIFFOUT_B12P) ; also sheet 14
3V3_PIN5~: IC6.57(_PART_4_OF_10:DIFFIO_TX_RX_B14N/DIFFOUT_B14N) ; also sheet 14
3V3_PIN6~: IC6.58(_PART_4_OF_10:DIFFIO_TX_RX_B14P/DIFFOUT_B14P) ; also sheet 14
3V3_PIN7: IC6.59(_PART_4_OF_10:DIFFIO_TX_RX_B16N/DIFFOUT_B16N) ; also sheet 14
+3V3 [supply]: IC6.40(_PART_4_OF_10:VCCIO3_1) IC6.49(_PART_4_OF_10:VCCIO3_2) ; also sheet 2,3,4,6,7,8,10,11,12,13,14
CODEC_FSYNC_N: IC6.43(_PART_4_OF_10:DIFFIO_TX_RX_B3P/DIFFOUT_B3P) ; also sheet 7
CODEC_MCLK: IC6.41(_PART_4_OF_10:DIFFIO_TX_RX_B3N/DIFFOUT_B3N) ; also sheet 7
CODEC_RESET_N: IC6.39(_PART_4_OF_10:DIFFIO_TX_RX_B1P/DIFFOUT_B1P) ; also sheet 7
CODEC_SCLK: IC6.38(_PART_4_OF_10:DIFFIO_TX_RX_B1N/DIFFOUT_B1N) ; also sheet 7
CODEC_SDI: IC6.45(_PART_4_OF_10:DIFFIO_TX_RX_B5P/DIFFOUT_B5P) ; also sheet 7
CODEC_SDO: IC6.44(_PART_4_OF_10:DIFFIO_TX_RX_B5N/DIFFOUT_B5N) ; also sheet 7
JTAG_PIN6: IC6.46(_PART_4_OF_10:DIFFIO_TX_RX_B7N/DIFFOUT_B7N) ; also sheet 10
JTAG_PIN7: IC6.60(_PART_4_OF_10:DIFFIO_TX_RX_B16P/DIFFOUT_B16P) ; also sheet 10
JTAG_PIN8: IC6.47(_PART_4_OF_10:DIFFIO_TX_RX_B7P/DIFFOUT_B7P) ; also sheet 10
Unconnected: IC6.48(_PART_4_OF_10:VREFB3N0)

### Notes on the sheet
- FPGA - PUSH BUTTON / IO
- 09 | 14

## Sheet 10 of 14
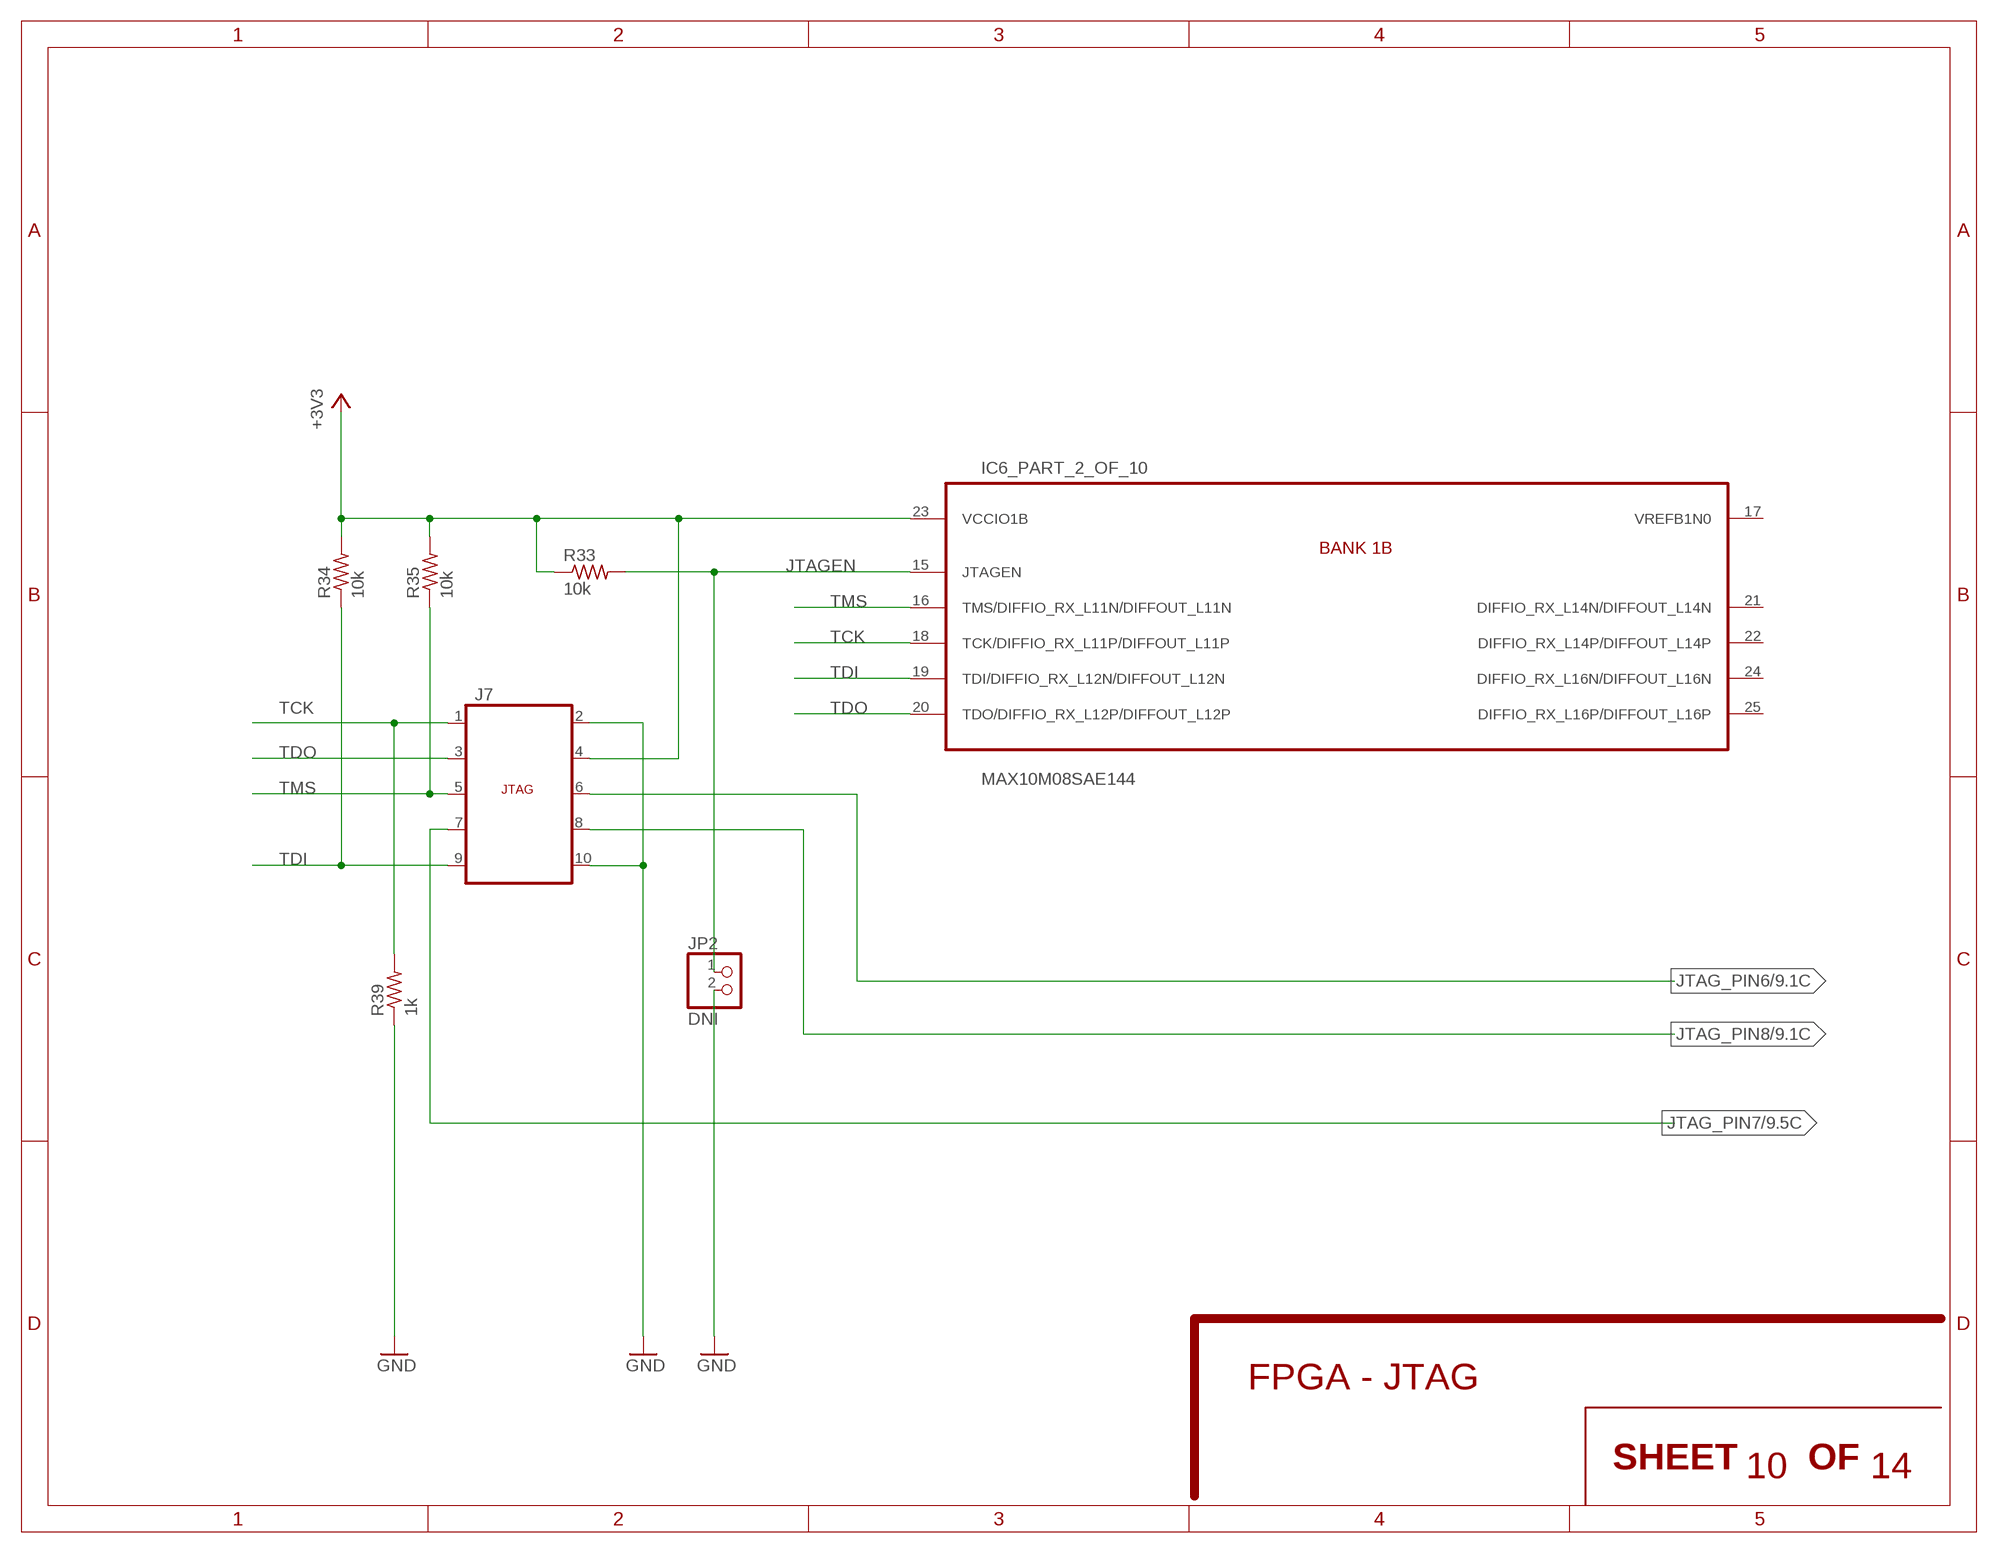
[diagram p9: schematic, sheet 10]

### Parts
J7  ALTERA_JTAG  [2X05]
JP2  DNI  PINHD-1X2  [1X02]
R33  10k  R-US_10K_YAGEO  [VISHAY-R-0603]
R34  10k  R-US_10K_YAGEO  [VISHAY-R-0603]
R35  10k  R-US_10K_YAGEO  [VISHAY-R-0603]
R39  1k  R-US_1K  [VISHAY-R-0603]

### Nets
+3V3 [supply]: IC6.23(_PART_2_OF_10:VCCIO1B) J7.4 R33.P$1 R34.P$2 R35.P$2 ; also sheet 2,3,4,6,7,8,9,11,12,13,14
GND [supply]: J7.2 J7.10 JP2.2 R39.P$1 ; also sheet 2,3,4,7,8,11,12,13,14
JTAG_PIN6: J7.6 ; also sheet 9
JTAG_PIN7: J7.7 ; also sheet 9
JTAG_PIN8: J7.8 ; also sheet 9
JTAGEN: IC6.15(_PART_2_OF_10:JTAGEN) JP2.1 R33.P$2
TCK: IC6.18(_PART_2_OF_10:TCK/DIFFIO_RX_L11P/DIFFOUT_L11P) J7.1 R39.P$2
TDI: IC6.19(_PART_2_OF_10:TDI/DIFFIO_RX_L12N/DIFFOUT_L12N) J7.9 R34.P$1
TDO: IC6.20(_PART_2_OF_10:TDO/DIFFIO_RX_L12P/DIFFOUT_L12P) J7.3
TMS: IC6.16(_PART_2_OF_10:TMS/DIFFIO_RX_L11N/DIFFOUT_L11N) J7.5 R35.P$1
Unconnected: IC6.17(_PART_2_OF_10:VREFB1N0) IC6.21(_PART_2_OF_10:DIFFIO_RX_L14N/DIFFOUT_L14N) IC6.22(_PART_2_OF_10:DIFFIO_RX_L14P/DIFFOUT_L14P) IC6.24(_PART_2_OF_10:DIFFIO_RX_L16N/DIFFOUT_L16N) IC6.25(_PART_2_OF_10:DIFFIO_RX_L16P/DIFFOUT_L16P)

### Notes on the sheet
- FPGA - JTAG
- 10 | 14

## Sheet 11 of 14
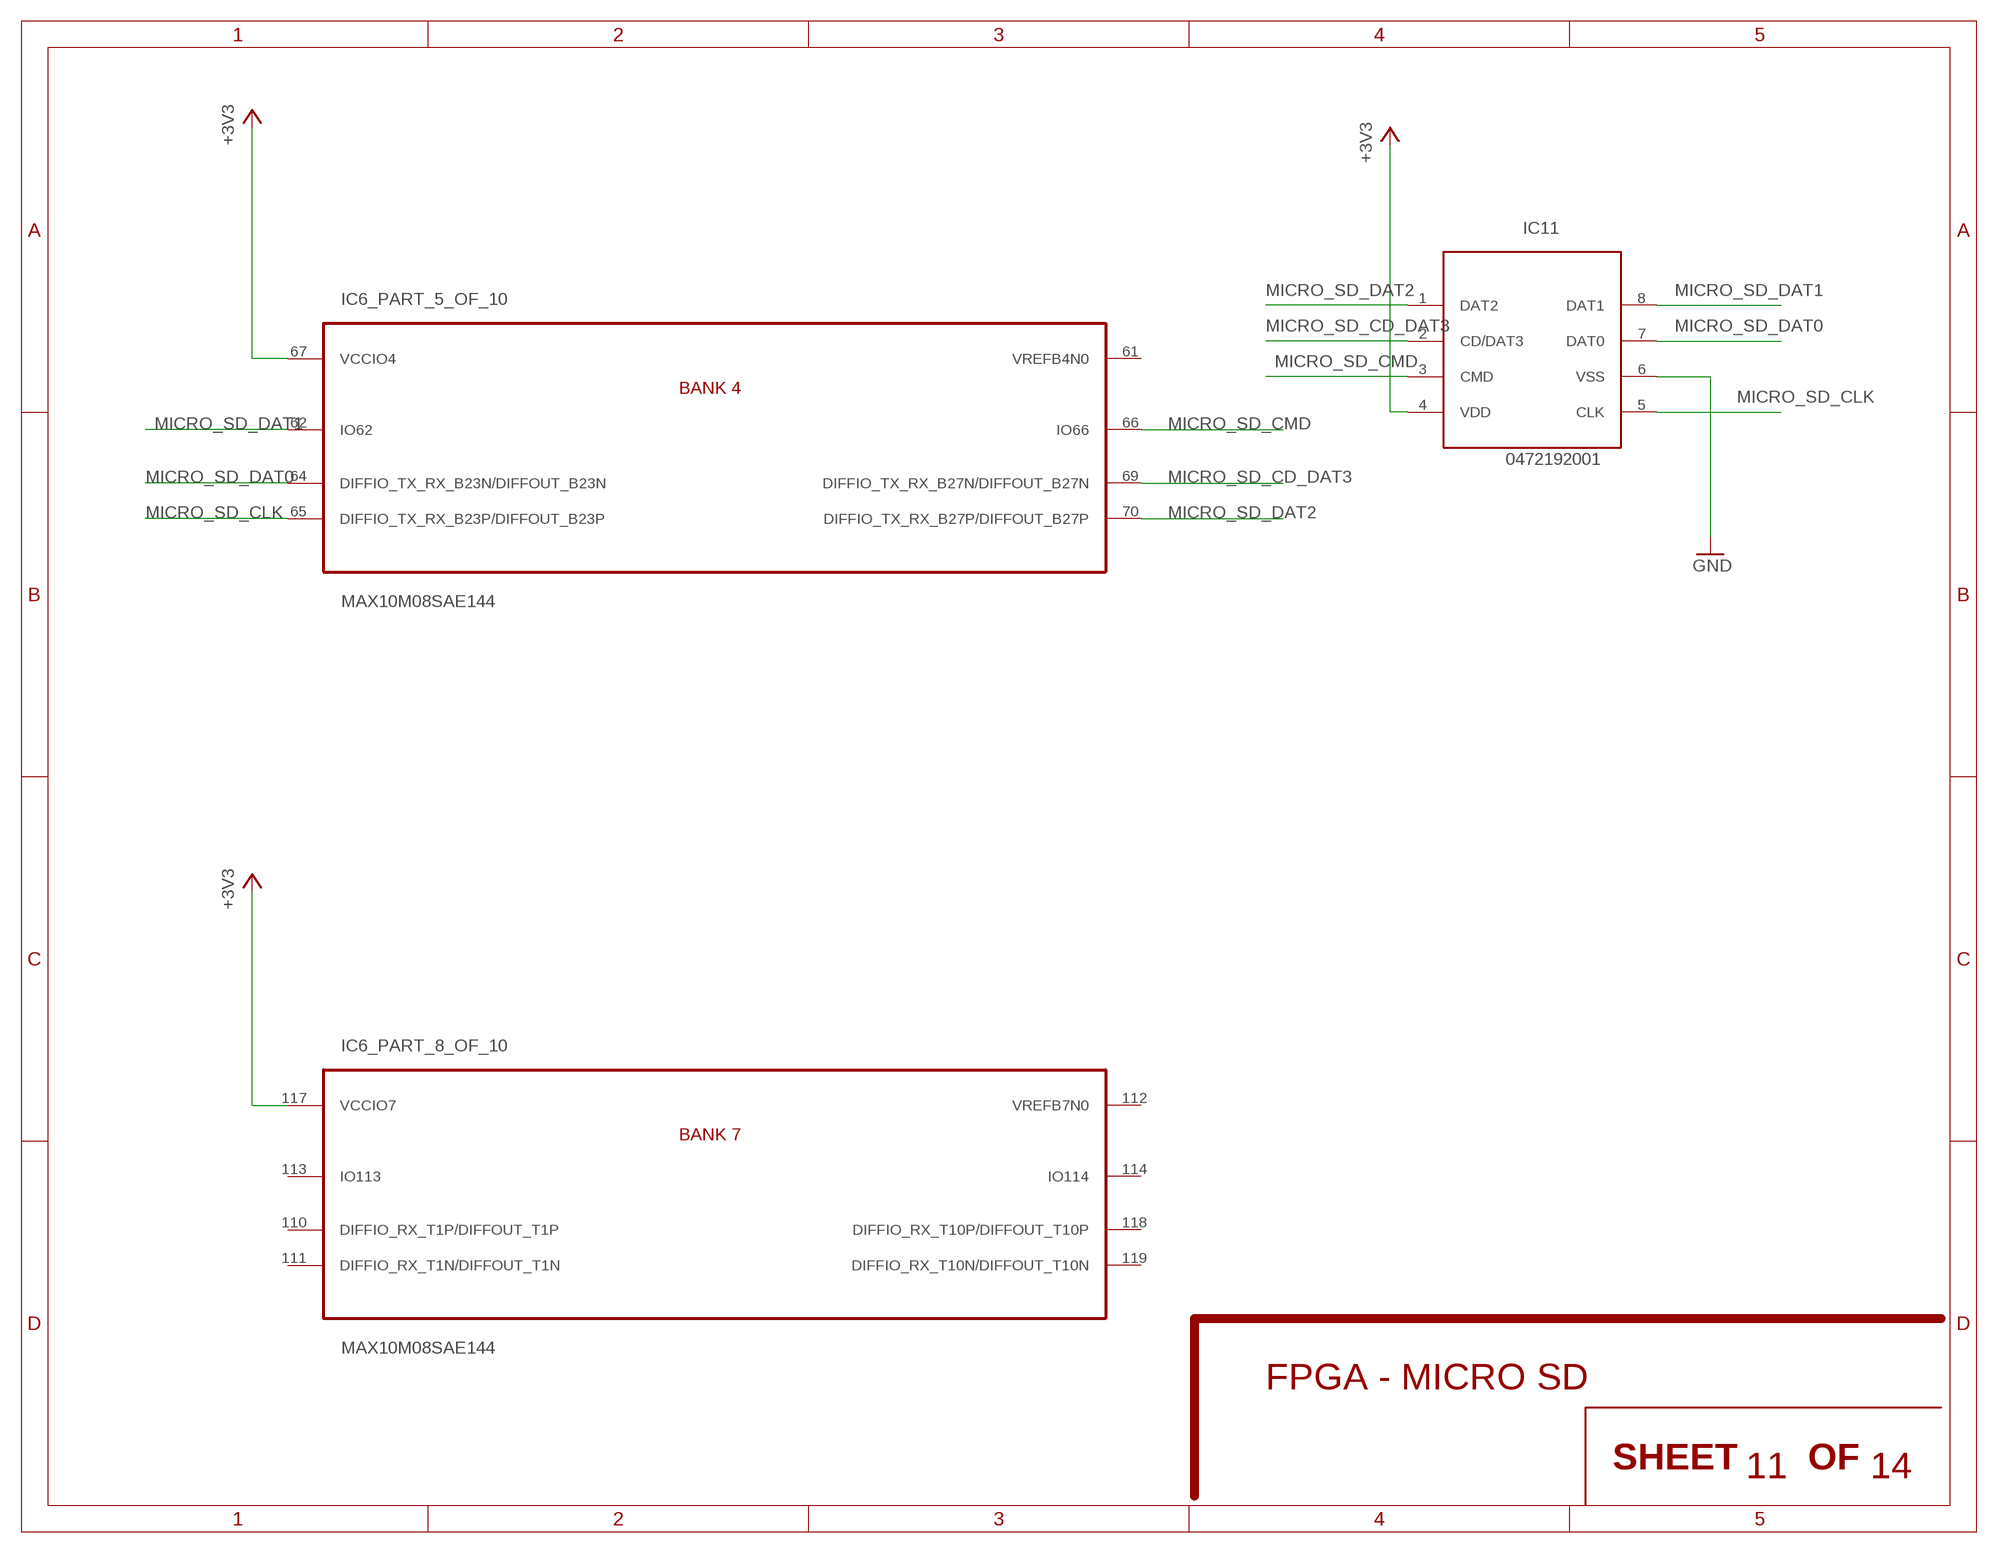
[diagram p10: schematic, sheet 11]

### Parts
IC11  0472192001  MOLEX-0472192001  [MOLEX-0472192001]

### Nets
+3V3 [supply]: IC6.67(_PART_5_OF_10:VCCIO4) IC6.117(_PART_8_OF_10:VCCIO7) IC11.4(VDD) ; also sheet 2,3,4,6,7,8,9,10,12,13,14
GND [supply]: IC11.6(VSS) ; also sheet 2,3,4,7,8,10,12,13,14
MICRO_SD_CD_DAT3: IC6.69(_PART_5_OF_10:DIFFIO_TX_RX_B27N/DIFFOUT_B27N) IC11.2(CD/DAT3)
MICRO_SD_CLK: IC6.65(_PART_5_OF_10:DIFFIO_TX_RX_B23P/DIFFOUT_B23P) IC11.5(CLK)
MICRO_SD_CMD: IC6.66(_PART_5_OF_10:IO66) IC11.3(CMD)
MICRO_SD_DAT0: IC6.64(_PART_5_OF_10:DIFFIO_TX_RX_B23N/DIFFOUT_B23N) IC11.7(DAT0)
MICRO_SD_DAT1: IC6.62(_PART_5_OF_10:IO62) IC11.8(DAT1)
MICRO_SD_DAT2: IC6.70(_PART_5_OF_10:DIFFIO_TX_RX_B27P/DIFFOUT_B27P) IC11.1(DAT2)
Unconnected: IC6.61(_PART_5_OF_10:VREFB4N0) IC6.110(_PART_8_OF_10:DIFFIO_RX_T1P/DIFFOUT_T1P) IC6.111(_PART_8_OF_10:DIFFIO_RX_T1N/DIFFOUT_T1N) IC6.112(_PART_8_OF_10:VREFB7N0) IC6.113(_PART_8_OF_10:IO113) IC6.114(_PART_8_OF_10:IO114) IC6.118(_PART_8_OF_10:DIFFIO_RX_T10P/DIFFOUT_T10P) IC6.119(_PART_8_OF_10:DIFFIO_RX_T10N/DIFFOUT_T10N)

### Notes on the sheet
- FPGA - MICRO SD
- 11 | 14

## Sheet 12 of 14
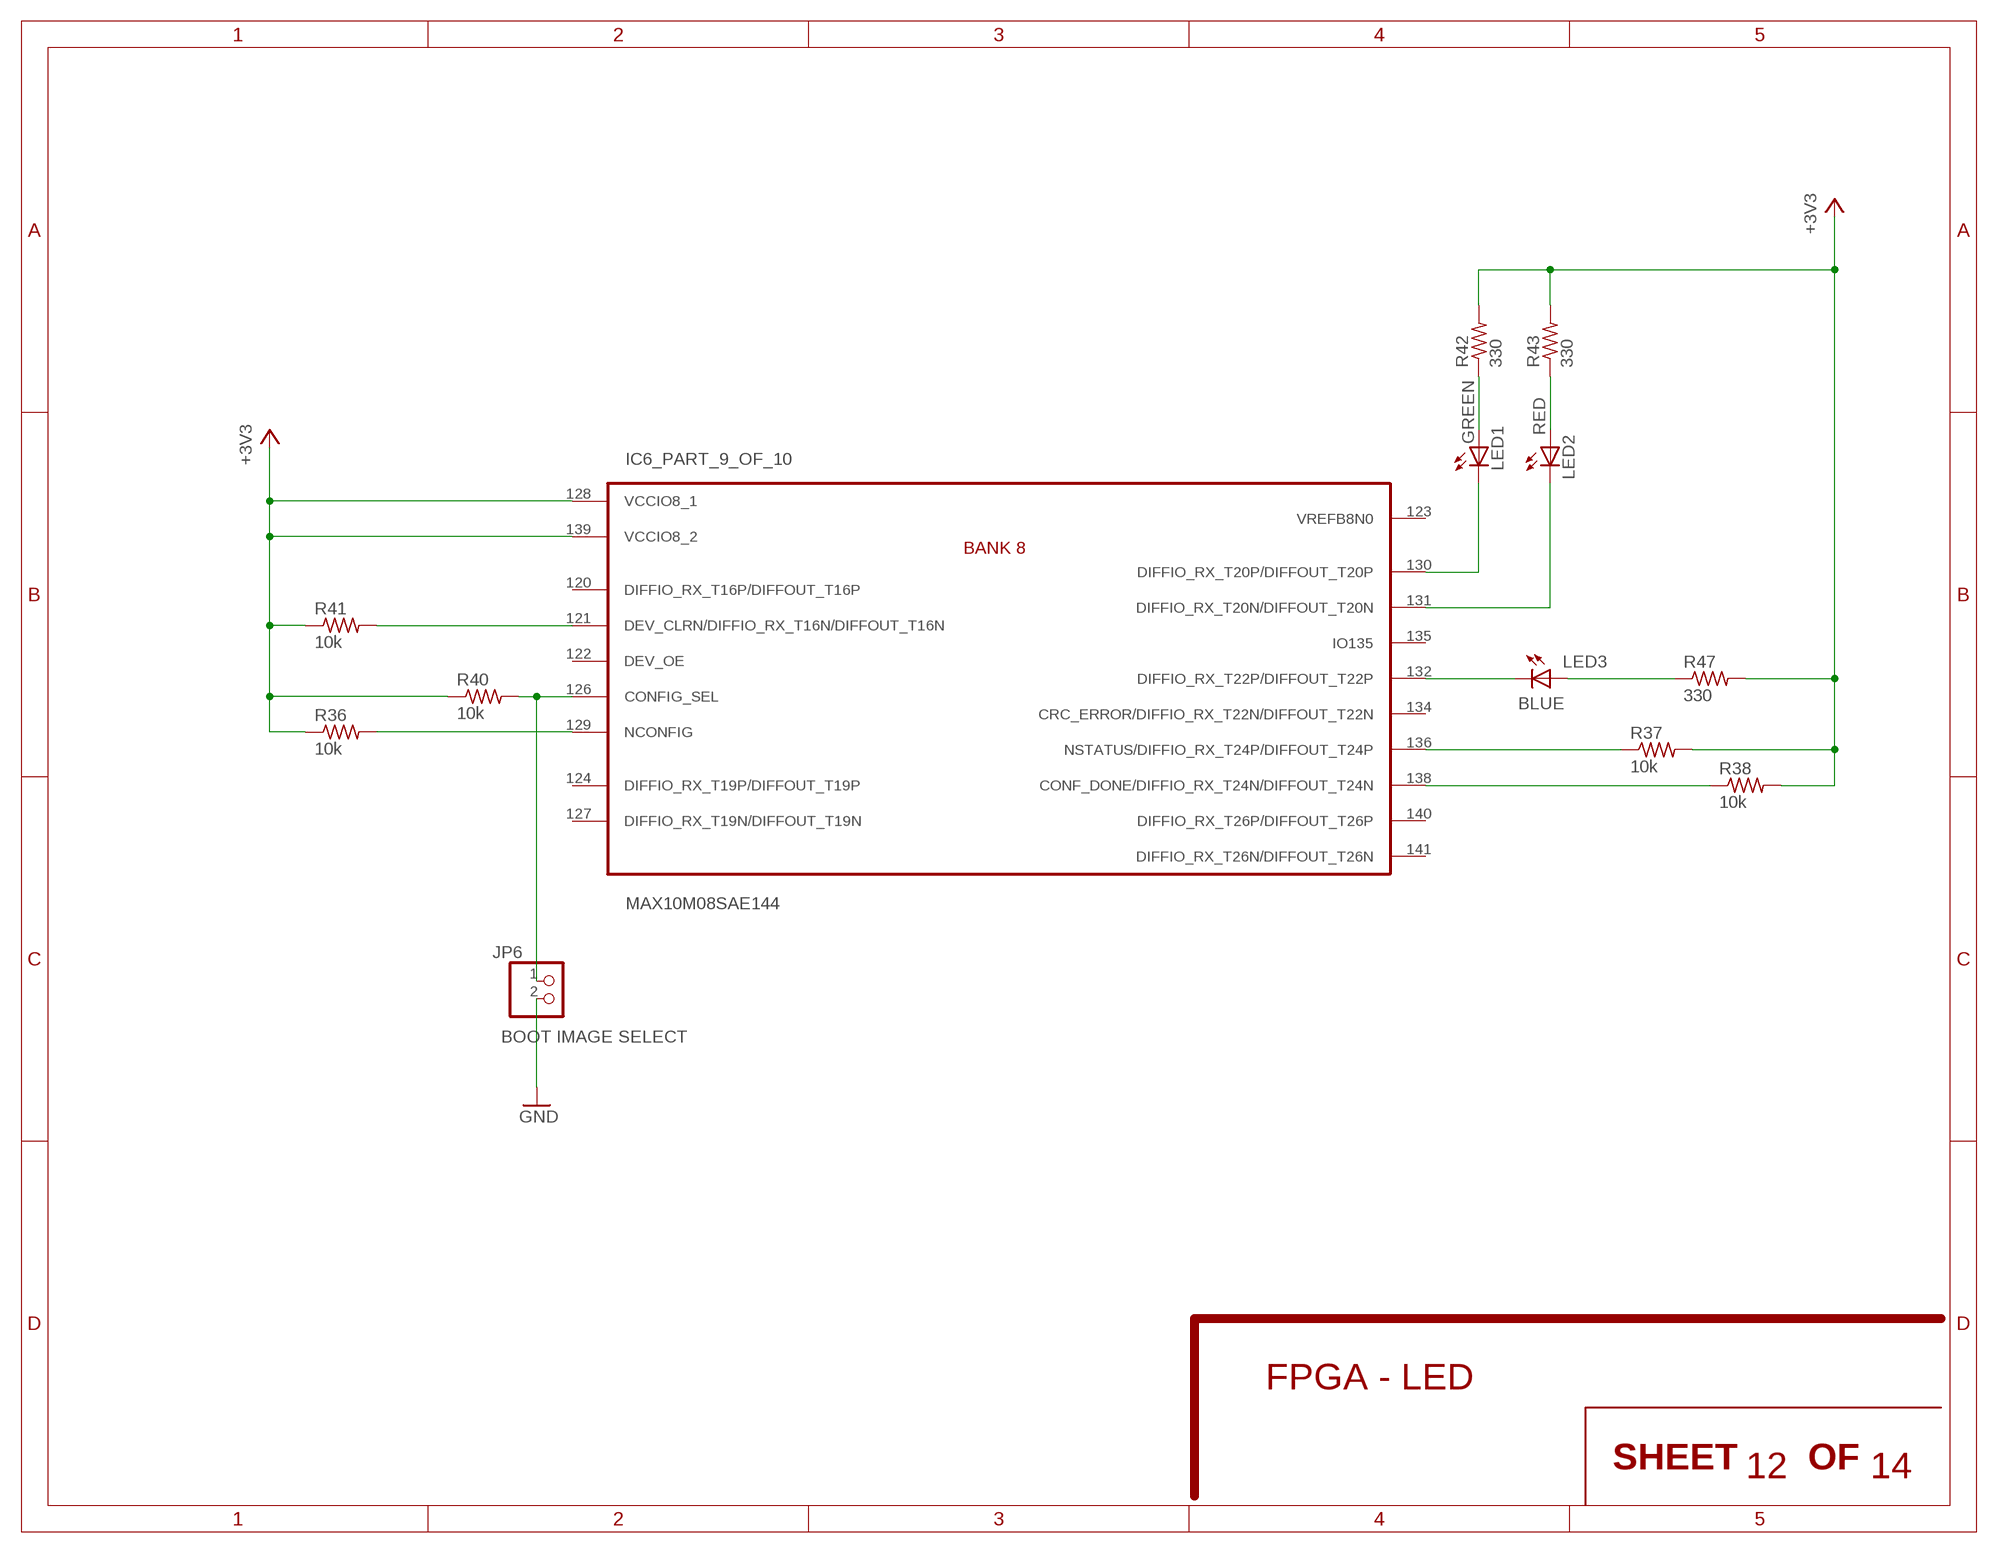
[diagram p11: schematic, sheet 12]

### Parts
JP6  BOOT IMAGE SELECT  PINHD-1X2  [1X02]
LED1  GREEN  HT--193UYG-5592-GREEN  [HARVATEK_0603]
LED2  RED  HT--191URO-5502-RED  [HARVATEK_0603]
LED3  BLUE  HT--193NB-5589-BLUE  [HARVATEK_0603]
R36  10k  R-US_10K_YAGEO  [VISHAY-R-0603]
R37  10k  R-US_10K_YAGEO  [VISHAY-R-0603]
R38  10k  R-US_10K_YAGEO  [VISHAY-R-0603]
R40  10k  R-US_10K_YAGEO  [VISHAY-R-0603]
R41  10k  R-US_10K_YAGEO  [VISHAY-R-0603]
R42  330  R-US_330_YAGEO  [VISHAY-R-0603]
R43  330  R-US_330_YAGEO  [VISHAY-R-0603]
R47  330  R-US_330_YAGEO  [VISHAY-R-0603]

### Nets
+3V3 [supply]: IC6.128(_PART_9_OF_10:VCCIO8_1) IC6.139(_PART_9_OF_10:VCCIO8_2) R36.P$1 R37.P$2 R38.P$2 R40.P$1 R41.P$1 R42.P$2 R43.P$2 R47.P$2 ; also sheet 2,3,4,6,7,8,9,10,11,13,14
GND [supply]: JP6.2 ; also sheet 2,3,4,7,8,10,11,13,14
N$11: IC6.132(_PART_9_OF_10:DIFFIO_RX_T22P/DIFFOUT_T22P) LED3.C
N$67: IC6.129(_PART_9_OF_10:NCONFIG) R36.P$2
N$68: IC6.136(_PART_9_OF_10:NSTATUS/DIFFIO_RX_T24P/DIFFOUT_T24P) R37.P$1
N$69: IC6.138(_PART_9_OF_10:CONF_DONE/DIFFIO_RX_T24N/DIFFOUT_T24N) R38.P$1
N$70: IC6.126(_PART_9_OF_10:CONFIG_SEL) JP6.1 R40.P$2
N$71: IC6.121(_PART_9_OF_10:DEV_CLRN/DIFFIO_RX_T16N/DIFFOUT_T16N) R41.P$2
N$72: IC6.130(_PART_9_OF_10:DIFFIO_RX_T20P/DIFFOUT_T20P) LED1.C
N$73: IC6.131(_PART_9_OF_10:DIFFIO_RX_T20N/DIFFOUT_T20N) LED2.C
N$77: LED1.A R42.P$1
N$78: LED2.A R43.P$1
N$83: LED3.A R47.P$1
Unconnected: IC6.120(_PART_9_OF_10:DIFFIO_RX_T16P/DIFFOUT_T16P) IC6.122(_PART_9_OF_10:DEV_OE) IC6.123(_PART_9_OF_10:VREFB8N0) IC6.124(_PART_9_OF_10:DIFFIO_RX_T19P/DIFFOUT_T19P) IC6.127(_PART_9_OF_10:DIFFIO_RX_T19N/DIFFOUT_T19N) IC6.134(_PART_9_OF_10:CRC_ERROR/DIFFIO_RX_T22N/DIFFOUT_T22N) IC6.135(_PART_9_OF_10:IO135) IC6.140(_PART_9_OF_10:DIFFIO_RX_T26P/DIFFOUT_T26P) IC6.141(_PART_9_OF_10:DIFFIO_RX_T26N/DIFFOUT_T26N)

### Notes on the sheet
- FPGA - LED
- 12 | 14

## Sheet 13 of 14
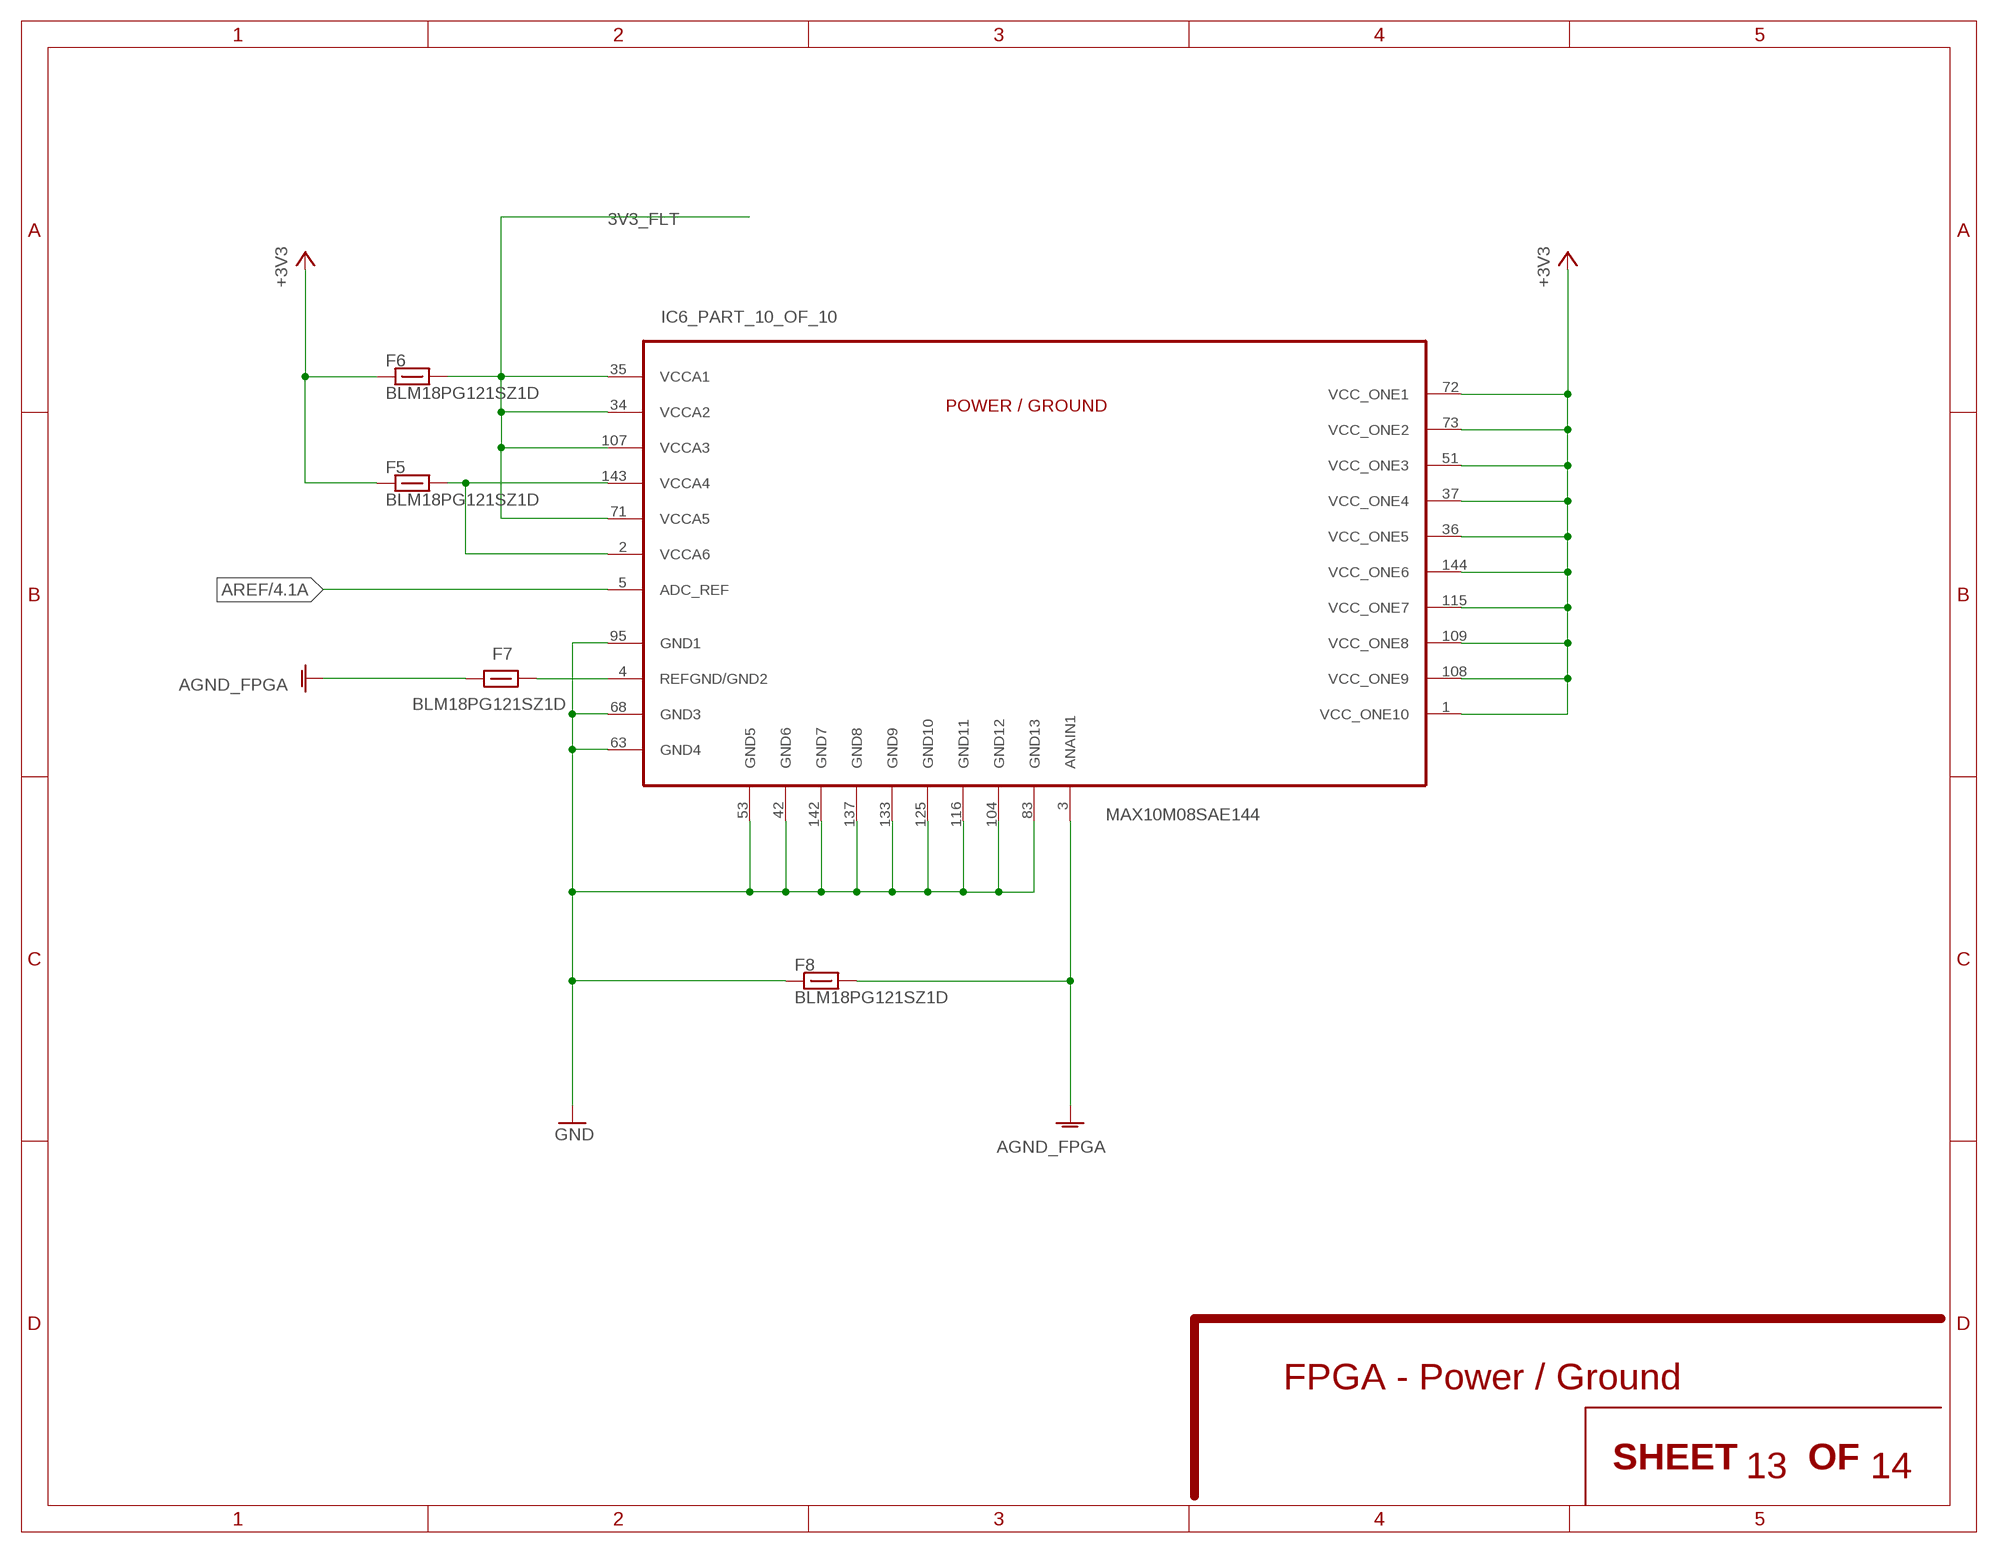
[diagram p12: schematic, sheet 13]

### Parts
F5  BLM18PG121SZ1D  BLM18PG  [0603-BEAD]
F6  BLM18PG121SZ1D  BLM18PG  [0603-BEAD]
F7  BLM18PG121SZ1D  BLM18PG  [0603-BEAD]
F8  BLM18PG121SZ1D  BLM18PG  [0603-BEAD]

### Nets
3V3_FLT: F6.2 IC6.34(_PART_10_OF_10:VCCA2) IC6.35(_PART_10_OF_10:VCCA1) IC6.71(_PART_10_OF_10:VCCA5) IC6.107(_PART_10_OF_10:VCCA3) ; also sheet 7
+3V3 [supply]: F5.1 F6.1 IC6.1(_PART_10_OF_10:VCC_ONE10) IC6.36(_PART_10_OF_10:VCC_ONE5) IC6.37(_PART_10_OF_10:VCC_ONE4) IC6.51(_PART_10_OF_10:VCC_ONE3) IC6.72(_PART_10_OF_10:VCC_ONE1) IC6.73(_PART_10_OF_10:VCC_ONE2) IC6.108(_PART_10_OF_10:VCC_ONE9) IC6.109(_PART_10_OF_10:VCC_ONE8) IC6.115(_PART_10_OF_10:VCC_ONE7) IC6.144(_PART_10_OF_10:VCC_ONE6) ; also sheet 2,3,4,6,7,8,9,10,11,12,14
AGND_FPGA [supply]: F7.1 F8.2 IC6.3(_PART_10_OF_10:ANAIN1) ; also sheet 5,6
AREF: IC6.5(_PART_10_OF_10:ADC_REF) ; also sheet 4
GND [supply]: F8.1 IC6.42(_PART_10_OF_10:GND6) IC6.53(_PART_10_OF_10:GND5) IC6.63(_PART_10_OF_10:GND4) IC6.68(_PART_10_OF_10:GND3) IC6.83(_PART_10_OF_10:GND13) IC6.95(_PART_10_OF_10:GND1) IC6.104(_PART_10_OF_10:GND12) IC6.116(_PART_10_OF_10:GND11) IC6.125(_PART_10_OF_10:GND10) IC6.133(_PART_10_OF_10:GND9) IC6.137(_PART_10_OF_10:GND8) IC6.142(_PART_10_OF_10:GND7) ; also sheet 2,3,4,7,8,10,11,12,14
N$40: F5.2 IC6.2(_PART_10_OF_10:VCCA6) IC6.143(_PART_10_OF_10:VCCA4)
N$85: F7.2 IC6.4(_PART_10_OF_10:REFGND/GND2)

### Notes on the sheet
- FPGA - Power / Ground
- 13 | 14

## Sheet 14 of 14
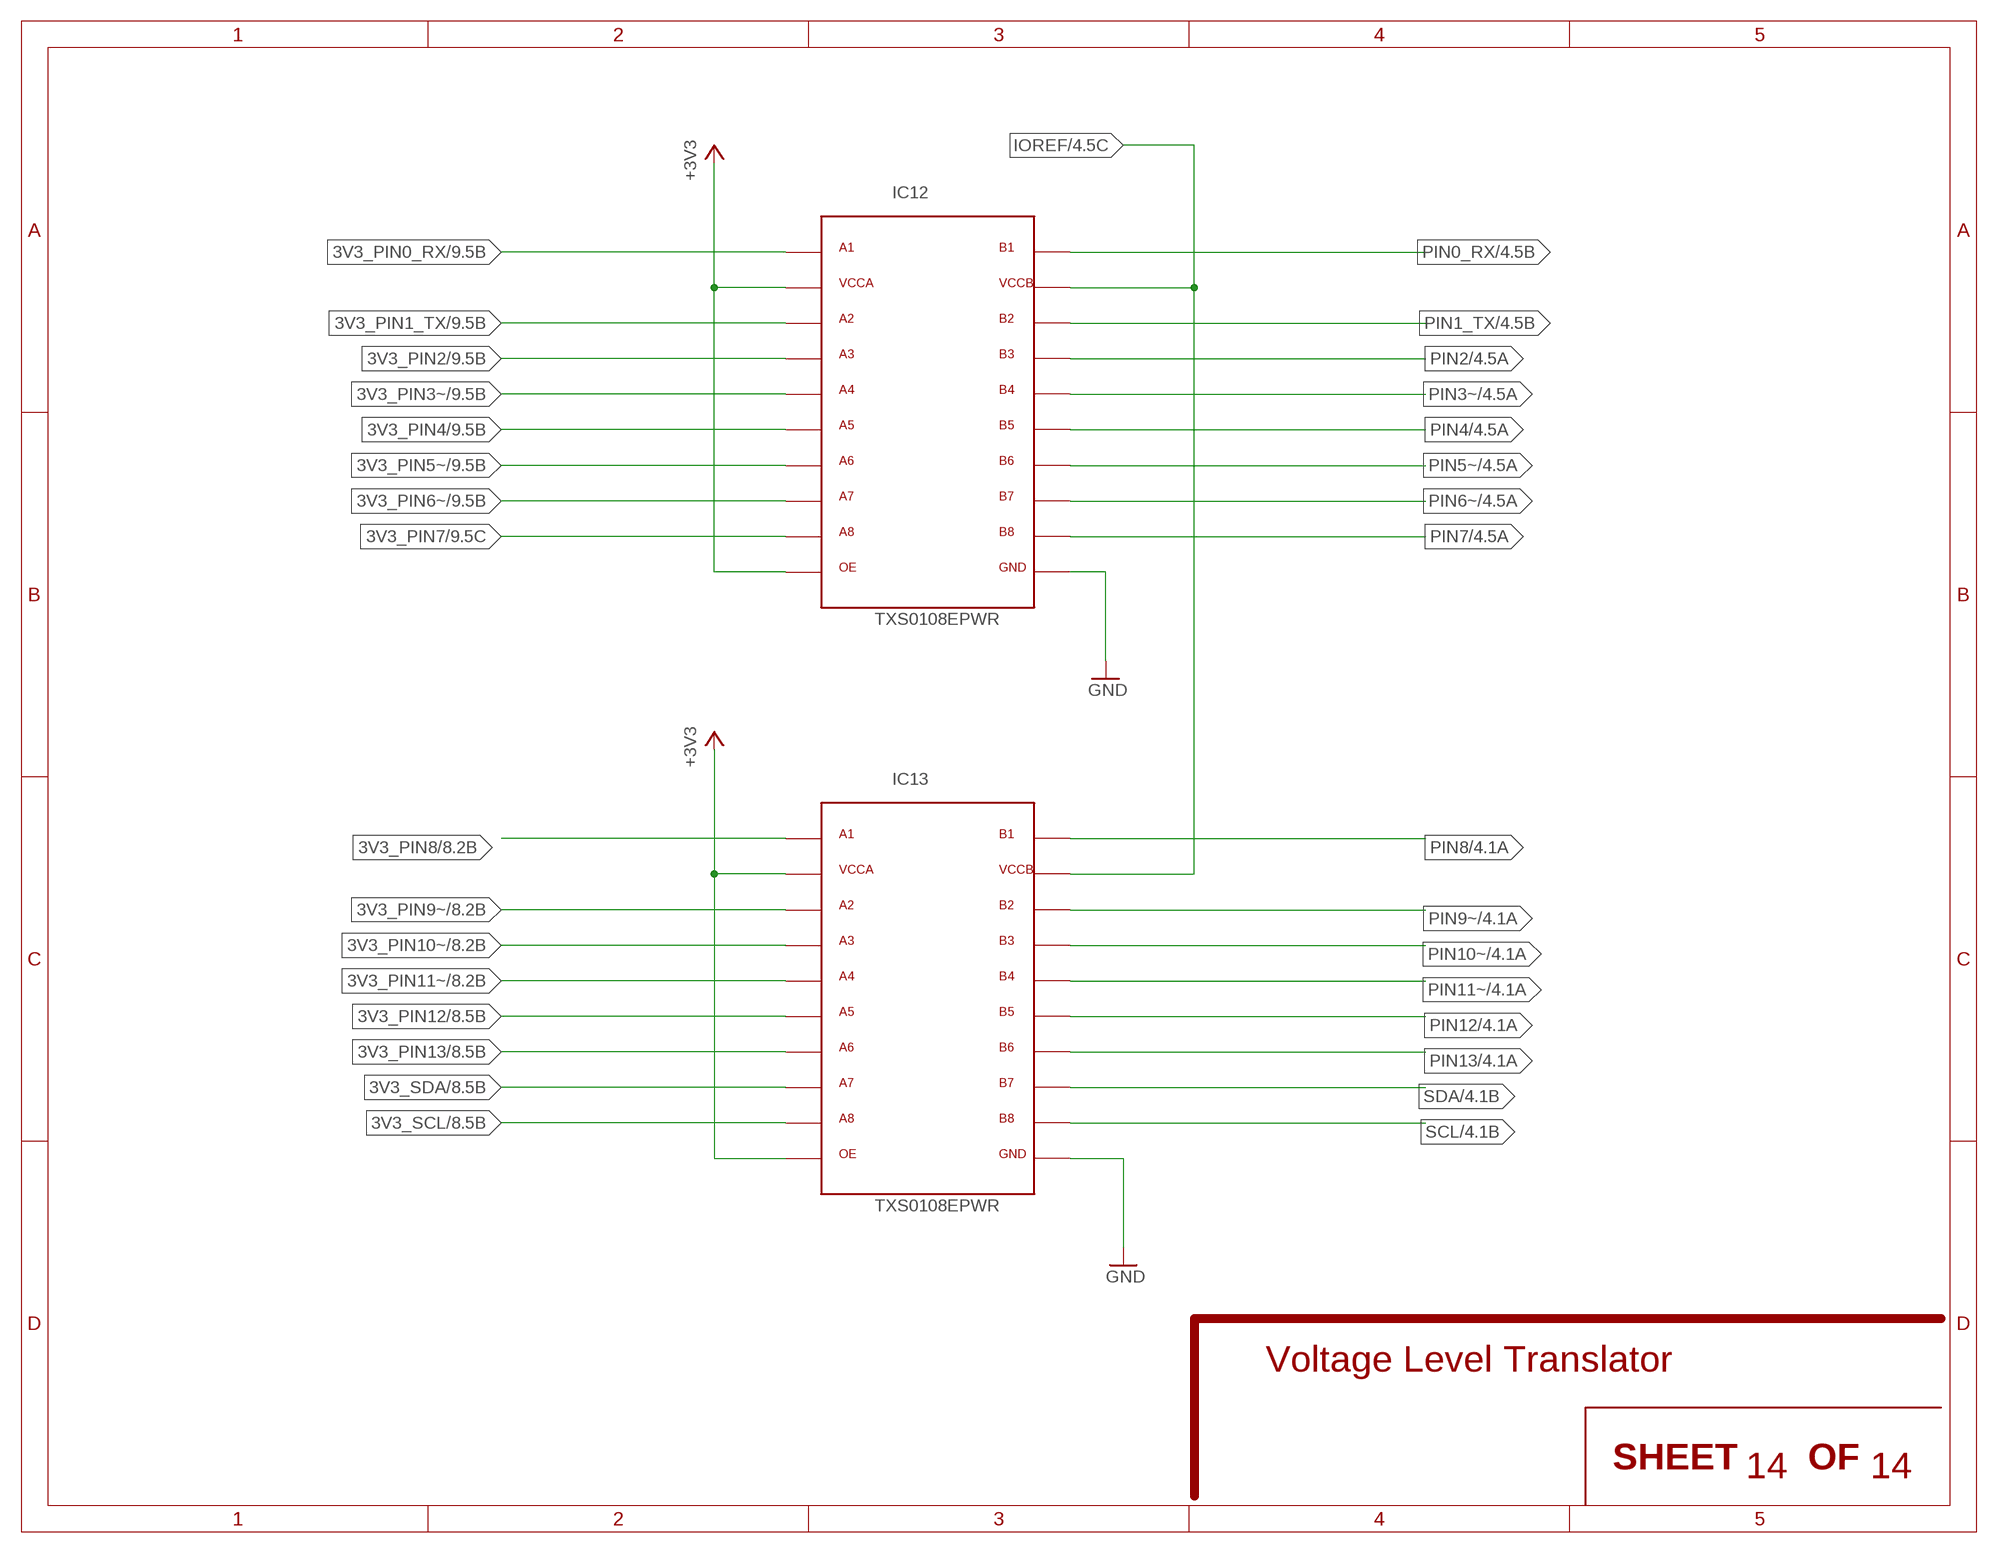
[diagram p13: schematic, sheet 14]

### Parts
IC12  TXS0108EPWR  TXS0108E  [TSSOP8]
IC13  TXS0108EPWR  TXS0108E  [TSSOP8]

### Nets
3V3_PIN0_RX: IC12.1 ; also sheet 9
3V3_PIN1_TX: IC12.3 ; also sheet 9
3V3_PIN2: IC12.4 ; also sheet 9
3V3_PIN3~: IC12.5 ; also sheet 9
3V3_PIN4: IC12.6 ; also sheet 9
3V3_PIN5~: IC12.7 ; also sheet 9
3V3_PIN6~: IC12.8 ; also sheet 9
3V3_PIN7: IC12.9 ; also sheet 9
3V3_PIN8: IC13.1 ; also sheet 8
3V3_PIN9~: IC13.3 ; also sheet 8
3V3_PIN10~: IC13.4 ; also sheet 8
3V3_PIN11~: IC13.5 ; also sheet 8
3V3_PIN12: IC13.6 ; also sheet 8
3V3_PIN13: IC13.7 ; also sheet 8
3V3_SCL: IC13.9 ; also sheet 8
3V3_SDA: IC13.8 ; also sheet 8
+3V3 [supply]: IC12.2 IC12.10 IC13.2 IC13.10 ; also sheet 2,3,4,6,7,8,9,10,11,12,13
GND [supply]: IC12.11 IC13.11 ; also sheet 2,3,4,7,8,10,11,12,13
IOREF: IC12.19 IC13.19 ; also sheet 4
PIN0_RX: IC12.20 ; also sheet 4
PIN1_TX: IC12.18 ; also sheet 4
PIN2: IC12.17 ; also sheet 4
PIN3~: IC12.16 ; also sheet 4
PIN4: IC12.15 ; also sheet 4
PIN5~: IC12.14 ; also sheet 4
PIN6~: IC12.13 ; also sheet 4
PIN7: IC12.12 ; also sheet 4
PIN8: IC13.20 ; also sheet 4
PIN9~: IC13.18 ; also sheet 4
PIN10~: IC13.17 ; also sheet 4
PIN11~: IC13.16 ; also sheet 4
PIN12: IC13.15 ; also sheet 4
PIN13: IC13.14 ; also sheet 4
SCL: IC13.12 ; also sheet 4
SDA: IC13.13 ; also sheet 4

### Notes on the sheet
- Voltage Level Translator
- 14 | 14

## Library data of the parts
C1 C2 C5 C9 C26 = PulseRain_RLC:CPOL_US: POLARIZED CAPACITOR, American symbol; MF: Panasonic; MPN: EEE-FK1A220AR
C3 C10 C11 C18 = PulseRain_RLC:C-US: SMD capacitor; MF: Vishay; MPN: VJ0603Y104JXJPW1BC
C4 = PulseRain_RLC:C-US: SMD capacitor; MF: Vishay; MPN: VJ0603A220JXACW1BC
C6 C7 C25 = PulseRain_RLC:C-US: SMD capacitor; MF: Vishay; MPN: VJ0603V105MXQPW1BC
C12-C17 = PulseRain_RLC:C-US: SMD capacitor; MF: Vishay; MPN: VJ0603A1R0BXACW1BC
C19-C24 = PulseRain_RLC:C-US: SMD capacitor; MF: Vishay; MPN: VJ0603Y102JXJPW1BC
D1 = PulseRain_NXP:PMEG3020: Schottky Diodes & Rectifiers SCHOTTKY DIODE; MF: NXP; MPN: PMEG3020ER
F1-F8 = PulseRain_RLC:BLM18: EMIFIL (R) Chip Ferrite Bead for GHz Noise Source: http://www.murata.com/ Ferrite Bead BLM15H.pdf; MF: muRata; MPN: BLM18PG121SZ1D
GND = PulseRain_Aesthetics:PULSERAIN_LOGO_BIGGER
IC1 = PulseRain_Diodes_Inc:AZ1117: LDO Voltage Regulators LDO BJT HiCurr 1.35A 10Hz to 10KHz; MF: Diodes Incorporated; MPN: AZ1117IH-5.0TRG1
IC2 = PulseRain_Diodes_Inc:AP3429: DIODE INC, 1.0MHZ, 2A STEP-DOWN DC-DC BUCK CONVERTER; MF: Diodes Incorporated; MPN: AP3429AKTTR-G1
IC3 = PulseRain_Silicon_Labs:SI3000: Interface - CODECs Voice Codec; MF: Silicon Labs; MPN: Si3000-C-FS
IC4 = PulseRain_Microchip:MCP6241: Operational Amplifiers - Op Amps Sgl 1.8V 650kHz Extended Temp; MF: Microchip Technology; MPN: MCP6241UT-E/LT
IC5 = PulseRain_FTDI:FT232R: http://www.ftdichip.com/Products/ICs/FT232R.htm; MF: FTDI; MPN: FT232RL
IC6 = PulseRain_Altera:MAX10M08SA: Altera MAX10 FPGA/CPLD; MF: Altera; MPN: 10M08SAE144C8G
IC7 = PulseRain_Microchip:MCP6242: 2 channel Operational Amplifiers; MF: Microchip Technology; MPN: MCP6242T-E/SN
IC8 = PulseRain_Microchip:MCP6244: 4 channel Operational Amplifiers; MF: Microchip Technology; MPN: MCP6244T-E/ST
IC9 = PulseRain_Clk_Reset:ACHL-DIP: DIP Oscillator; MF: ABRACON; MPN: ACHL-12.000MHZ-EK
IC10 = PulseRain_Microchip:23LC1024: SRAM 1024K 2.5V SPI SERIAL SRAM SQI; MF: Microchip Technology; MPN: 23LC1024-I/ST
IC11 = PulseRain_MISC:MOLEX-0472192001: Memory Card Connectors Slide In-Slide Out Headersmicro SD; MF: Molex; MPN: 0472192001
IC12 IC13 = PulseRain_TI:TXS0108E: Translation - Voltage Levels 8B Bidir Vltg-Level Translator; MF: Texas Instruments; MPN: TXS0108EPWR
J1 = PulseRain_CUI:PJ-051A: DC Power Connectors RT ANGL PWK JK PIN D; MF: CUI; MPN: PJ-051A
J2 = PulseRain_Molex:MICRO-USB-B-REC: MicroUSB-B; MF: Molex; MPN: 47346-1001
J4 = PulseRain_Switchcraft:PHONE_JACK_NOT_SWITCHED: Phone Jack not switched; MF: Switchcraft; MPN: 35RASMT2BHNTRX
J7 = PulseRain_Altera:ALTERA_JTAG: PIN HEADER; MF: Harwin; MPN: M20-9760546
J8 = PulseRain_Board:DUINO_IO_HEADER_10: 10 Position Header Connector 0.100 inch (2.54mm) Through Hole Tin; MF: Sullins Connector Solutions; MPN: PPTC101LFBN-RC
J9 = PulseRain_Board:DUINO_IO_HEADER_8: 8 Position Header Connector 0.100 inch (2.54mm) Through Hole Gold; MF: Sullins Connector Solutions; MPN: PPTC081LFBN-RC
J10 = PulseRain_Board:DUINO_PWR_HEADER_8: 8 Position Header Connector 0.100 inch (2.54mm) Through Hole Gold; MF: Sullins Connector Solutions; MPN: PPTC081LFBN-RC
J11 = PulseRain_Board:DUINO_ANALOG_HEADER_6: 6 Position Header Connector 0.100 inch (2.54mm) Through Hole Tin; MF: Sullins Connector Solutions; MPN: PPTC061LFBN-RC
JP1 = PulseRain_PINHEAD:PINHD-1X3: PIN HEADER; MF: Harwin; MPN: M20-9990346
JP2 JP6 = PulseRain_PINHEAD:PINHD-1X2: PIN HEADER; MF: Harwin; MPN: M20-9990246
L1 = PulseRain_RLC:L-US: SMD Inductor; MF: muRata; MPN: 1239AS-H-2R2M=P2
LED1 UART_TX = PulseRain_LED:HT-: Standard LEDs - SMD; MF: Inolux / Harvatek; MPN: HT-193UYG-5592
LED2 UART_RX = PulseRain_LED:HT-: Standard LEDs - SMD; MF: Inolux / Harvatek; MPN: HT-191URO-5502
LED3 LED_IOREF = PulseRain_LED:HT-: Standard LEDs - SMD; MF: Inolux / Harvatek; MPN: HT-193NB-5589
MIC1 = PulseRain_MISC:MIC-CUI: Two terminal Microphone; MF: CUI; MPN: CMC-5044PF-A
PMOS1 = PulseRain_MOSFET:PMOS: MOSFET 60V (D-S) -/+20V AEC-Q101 Qualified; MF: Vishay; MPN: SQ1421EDH-T1_GE3
PT1 = PulseRain_PIHER:PT10: potentiometer; MF: Piher; MPN: PT10LV10-204A2020
R1 R7 R8 R33-R38 R40 R41 = PulseRain_RLC:R-US: Thick Film Resistors - SMD; MF: YAGEO; MPN: RC0603FR-0710KL
R2 = PulseRain_RLC:R-US: Thick Film Resistors - SMD; MF: Vishay; MPN: CRCW0603226KFKEA
R3 = PulseRain_RLC:R-US: Thick Film Resistors - SMD; MF: Vishay; MPN: CRCW060349K9FKEA
R5 = PulseRain_RLC:R-US: Thick Film Resistors - SMD; MF: Vishay; MPN: CRCW06032K20FKEA
R6 R29 = PulseRain_RLC:R-US: Thick Film Resistors - SMD; MF: Vishay; MPN: CRCW060330R0FKEA
R9 R10 R22 R42 R43 R47 = PulseRain_RLC:R-US: Thick Film Resistors - SMD; MF: YAGEO; MPN: RC0603FR-07330RL
R11 R12 R14 R16 R18 R20 = PulseRain_RLC:R-US: Thick Film Resistors - SMD; MF: YAGEO; MPN: RC0603FR-07100KL
R13 R15 R17 R19 R21 = PulseRain_RLC:R-US: Thick Film Resistors - SMD; MF: Vishay; MPN: CRCW0603200KFKEA
R23-R28 = PulseRain_RLC:R-US: Thick Film Resistors - SMD; MF: Vishay; MPN: CRCW0603100RFKEA
R32 = PulseRain_RLC:R-US: Thick Film Resistors - SMD; MF: Vishay; MPN: CRCW060310K0FKEA
R39 = PulseRain_RLC:R-US: Thick Film Resistors - SMD; MF: Vishay; MPN: CRCW06031K00FKEA
SW1 SW2 = PulseRain_MISC:PUSH_BUTTON: push button; MF: TE Connectivity; MPN: 2-1437565-8
U$8 = PulseRain_Board:DUINO

## Net classes
0 default: width 0.203 mm, clearance 0.191 mm
1 supply: width 0.203 mm, clearance 0.191 mm
2 diff: width 0.203 mm, clearance 0.191 mm